# EAGLE design BB_DIO_Cape (EAGLE 6.5.0)

## Sheet 1 of 2
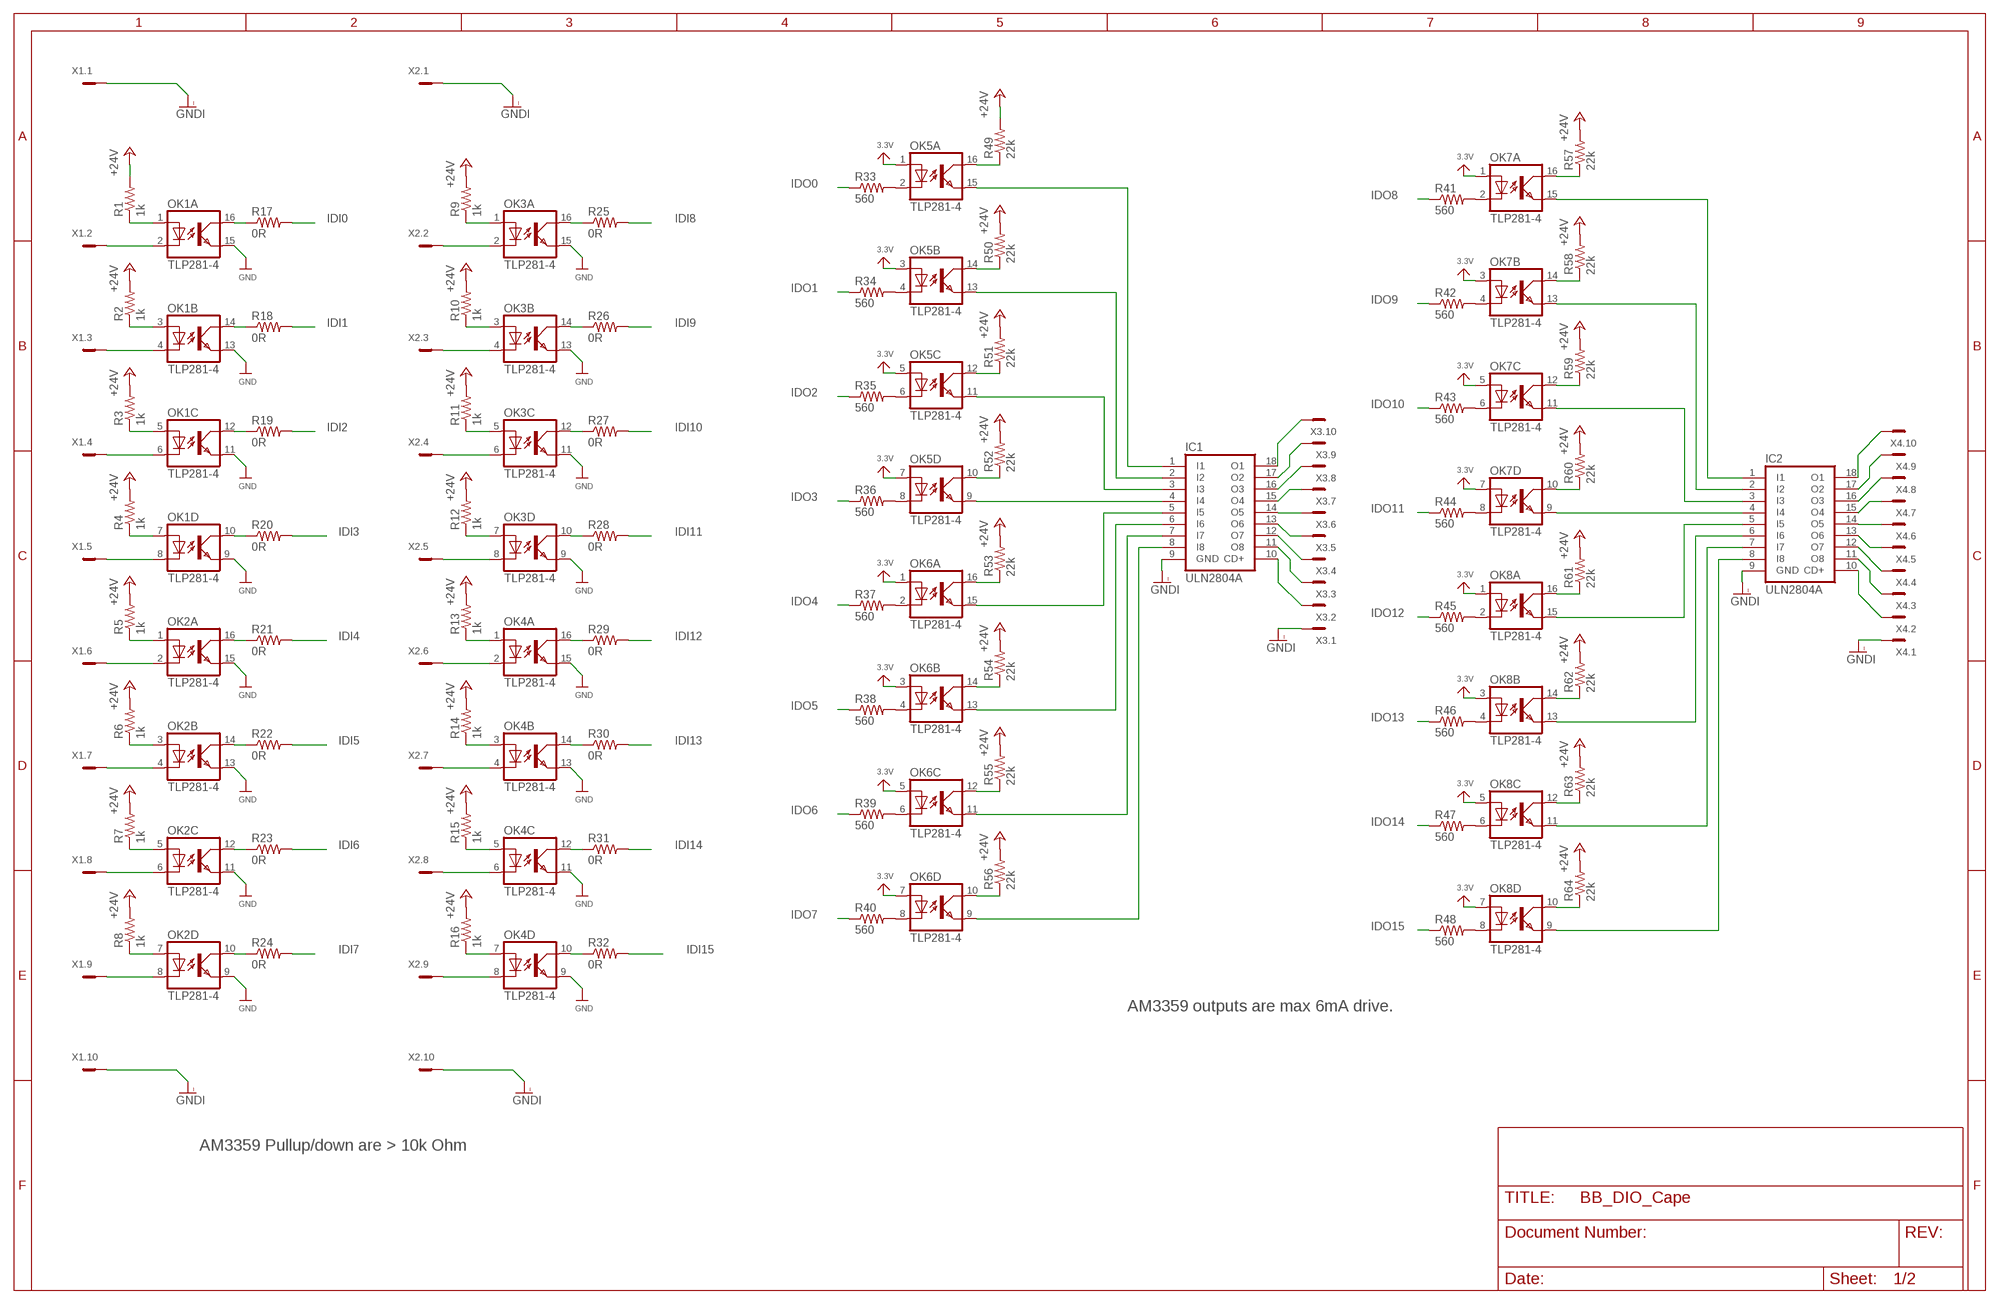
[diagram p0: schematic, sheet 1]

### Parts
IC1  ULN2804A  ULN2803ASOIC18  [SO18W]
IC2  ULN2804A  ULN2803ASOIC18  [SO18W]
OK1  TLP281-4  TLP283-4  [MINI-FLAT-16]
OK2  TLP281-4  TLP283-4  [MINI-FLAT-16]
OK3  TLP281-4  TLP283-4  [MINI-FLAT-16]
OK4  TLP281-4  TLP283-4  [MINI-FLAT-16]
OK5  TLP281-4  TLP283-4  [MINI-FLAT-16]
OK6  TLP281-4  TLP283-4  [MINI-FLAT-16]
OK7  TLP281-4  TLP283-4  [MINI-FLAT-16]
OK8  TLP281-4  TLP283-4  [MINI-FLAT-16]
R1  1k  R-US_R0603  [R0603]
R2  1k  R-US_R0603  [R0603]
R3  1k  R-US_R0603  [R0603]
R4  1k  R-US_R0603  [R0603]
R5  1k  R-US_R0603  [R0603]
R6  1k  R-US_R0603  [R0603]
R7  1k  R-US_R0603  [R0603]
R8  1k  R-US_R0603  [R0603]
R9  1k  R-US_R0603  [R0603]
R10  1k  R-US_R0603  [R0603]
R11  1k  R-US_R0603  [R0603]
R12  1k  R-US_R0603  [R0603]
R13  1k  R-US_R0603  [R0603]
R14  1k  R-US_R0603  [R0603]
R15  1k  R-US_R0603  [R0603]
R16  1k  R-US_R0603  [R0603]
R17  0R  R-US_R0603  [R0603]
R18  0R  R-US_R0603  [R0603]
R19  0R  R-US_R0603  [R0603]
R20  0R  R-US_R0603  [R0603]
R21  0R  R-US_R0603  [R0603]
R22  0R  R-US_R0603  [R0603]
R23  0R  R-US_R0603  [R0603]
R24  0R  R-US_R0603  [R0603]
R25  0R  R-US_R0603  [R0603]
R26  0R  R-US_R0603  [R0603]
R27  0R  R-US_R0603  [R0603]
R28  0R  R-US_R0603  [R0603]
R29  0R  R-US_R0603  [R0603]
R30  0R  R-US_R0603  [R0603]
R31  0R  R-US_R0603  [R0603]
R32  0R  R-US_R0603  [R0603]
R33  560  R-US_R0603  [R0603]
R34  560  R-US_R0603  [R0603]
R35  560  R-US_R0603  [R0603]
R36  560  R-US_R0603  [R0603]
R37  560  R-US_R0603  [R0603]
R38  560  R-US_R0603  [R0603]
R39  560  R-US_R0603  [R0603]
R40  560  R-US_R0603  [R0603]
R41  560  R-US_R0603  [R0603]
R42  560  R-US_R0603  [R0603]
R43  560  R-US_R0603  [R0603]
R44  560  R-US_R0603  [R0603]
R45  560  R-US_R0603  [R0603]
R46  560  R-US_R0603  [R0603]
R47  560  R-US_R0603  [R0603]
R48  560  R-US_R0603  [R0603]
R49  22k  R-US_R0603  [R0603]
R50  22k  R-US_R0603  [R0603]
R51  22k  R-US_R0603  [R0603]
R52  22k  R-US_R0603  [R0603]
R53  22k  R-US_R0603  [R0603]
R54  22k  R-US_R0603  [R0603]
R55  22k  R-US_R0603  [R0603]
R56  22k  R-US_R0603  [R0603]
R57  22k  R-US_R0603  [R0603]
R58  22k  R-US_R0603  [R0603]
R59  22k  R-US_R0603  [R0603]
R60  22k  R-US_R0603  [R0603]
R61  22k  R-US_R0603  [R0603]
R62  22k  R-US_R0603  [R0603]
R63  22k  R-US_R0603  [R0603]
R64  22k  R-US_R0603  [R0603]
X1  MC10  [MC10]
X2  MC10  [MC10]
X3  MC10  [MC10]
X4  MC10  [MC10]

### Nets
3.3V [power]: OK5.1(A:A) OK5.3(B:A) OK5.5(C:A) OK5.7(D:A) OK6.1(A:A) OK6.3(B:A) OK6.5(C:A) OK6.7(D:A) OK7.1(A:A) OK7.3(B:A) OK7.5(C:A) OK7.7(D:A) OK8.1(A:A) OK8.3(B:A) OK8.5(C:A) OK8.7(D:A) ; also sheet 2
+24V [power]: R1.2 R2.2 R3.2 R4.2 R5.2 R6.2 R7.2 R8.2 R9.2 R10.2 R11.2 R12.2 R13.2 R14.2 R15.2 R16.2 R49.2 R50.2 R51.2 R52.2 R53.2 R54.2 R55.2 R56.2 R57.2 R58.2 R59.2 R60.2 R61.2 R62.2 R63.2 R64.2 ; also sheet 2
GND [power]: OK1.9(D:EMIT) OK1.11(C:EMIT) OK1.13(B:EMIT) OK1.15(A:EMIT) OK2.9(D:EMIT) OK2.11(C:EMIT) OK2.13(B:EMIT) OK2.15(A:EMIT) OK3.9(D:EMIT) OK3.11(C:EMIT) OK3.13(B:EMIT) OK3.15(A:EMIT) OK4.9(D:EMIT) OK4.11(C:EMIT) OK4.13(B:EMIT) OK4.15(A:EMIT) ; also sheet 2
GNDI [power]: IC1.9(GND) IC2.9(GND) X1.1 X1.10 X2.1 X2.10 X3.1 X4.1 ; also sheet 2
IDI0: R17.2 ; also sheet 2
IDI1: R18.2 ; also sheet 2
IDI2: R19.2 ; also sheet 2
IDI3: R20.2 ; also sheet 2
IDI4: R21.2 ; also sheet 2
IDI5: R22.2 ; also sheet 2
IDI6: R23.2 ; also sheet 2
IDI7: R24.2 ; also sheet 2
IDI8: R25.2 ; also sheet 2
IDI9: R26.2 ; also sheet 2
IDI10: R27.2 ; also sheet 2
IDI11: R28.2 ; also sheet 2
IDI12: R29.2 ; also sheet 2
IDI13: R30.2 ; also sheet 2
IDI14: R31.2 ; also sheet 2
IDI15: R32.2
IDO0: R33.1 ; also sheet 2
IDO1: R34.1 ; also sheet 2
IDO2: R35.1 ; also sheet 2
IDO3: R36.1 ; also sheet 2
IDO4: R37.1 ; also sheet 2
IDO5: R38.1 ; also sheet 2
IDO6: R39.1 ; also sheet 2
IDO7: R40.1 ; also sheet 2
IDO8: R41.1 ; also sheet 2
IDO9: R42.1 ; also sheet 2
IDO10: R43.1 ; also sheet 2
IDO11: R44.1 ; also sheet 2
IDO12: R45.1 ; also sheet 2
IDO13: R46.1 ; also sheet 2
IDO14: R47.1 ; also sheet 2
IDO15: R48.1 ; also sheet 2
N$1: OK4.8(D:C) X2.9
N$2: OK4.7(D:A) R16.1
N$3: OK4.5(C:A) R15.1
N$4: OK4.6(C:C) X2.8
N$5: OK4.4(B:C) X2.7
N$6: OK4.3(B:A) R14.1
N$7: OK4.2(A:C) X2.6
N$8: OK4.1(A:A) R13.1
N$9: OK3.8(D:C) X2.5
N$10: OK3.7(D:A) R12.1
N$11: OK3.6(C:C) X2.4
N$12: OK3.5(C:A) R11.1
N$13: OK3.4(B:C) X2.3
N$14: OK3.3(B:A) R10.1
N$15: OK4.10(D:COL) R32.1
N$16: OK4.12(C:COL) R31.1
N$17: OK4.14(B:COL) R30.1
N$18: OK4.16(A:COL) R29.1
N$19: OK3.10(D:COL) R28.1
N$20: OK3.12(C:COL) R27.1
N$21: OK3.14(B:COL) R26.1
N$22: OK2.10(D:COL) R24.1
N$23: OK2.12(C:COL) R23.1
N$24: OK2.14(B:COL) R22.1
N$25: OK2.16(A:COL) R21.1
N$26: OK1.10(D:COL) R20.1
N$27: OK1.12(C:COL) R19.1
N$28: OK1.14(B:COL) R18.1
N$29: OK1.4(B:C) X1.3
N$30: OK1.3(B:A) R2.1
N$31: OK1.5(C:A) R3.1
N$32: OK1.6(C:C) X1.4
N$33: OK1.7(D:A) R4.1
N$34: OK1.8(D:C) X1.5
N$35: OK2.2(A:C) X1.6
N$36: OK2.1(A:A) R5.1
N$37: OK2.3(B:A) R6.1
N$38: OK2.4(B:C) X1.7
N$39: OK2.5(C:A) R7.1
N$40: OK2.6(C:C) X1.8
N$41: OK2.7(D:A) R8.1
N$42: OK2.8(D:C) X1.9
N$43: OK1.2(A:C) X1.2
N$44: OK1.1(A:A) R1.1
N$45: OK1.16(A:COL) R17.1
N$46: OK3.2(A:C) X2.2
N$47: OK3.1(A:A) R9.1
N$48: OK3.16(A:COL) R25.1
N$49: OK5.2(A:C) R33.2
N$50: OK5.4(B:C) R34.2
N$51: OK5.6(C:C) R35.2
N$52: OK5.8(D:C) R36.2
N$53: OK6.2(A:C) R37.2
N$54: OK6.4(B:C) R38.2
N$55: OK6.6(C:C) R39.2
N$56: OK6.8(D:C) R40.2
N$57: OK7.2(A:C) R41.2
N$58: OK7.4(B:C) R42.2
N$59: OK7.6(C:C) R43.2
N$60: OK7.8(D:C) R44.2
N$61: OK8.2(A:C) R45.2
N$62: OK8.4(B:C) R46.2
N$63: OK8.6(C:C) R47.2
N$64: OK8.8(D:C) R48.2
N$65: OK5.16(A:COL) R49.1
N$66: OK5.14(B:COL) R50.1
N$67: OK5.12(C:COL) R51.1
N$68: OK5.10(D:COL) R52.1
N$69: OK6.16(A:COL) R53.1
N$70: OK6.14(B:COL) R54.1
N$71: OK6.12(C:COL) R55.1
N$72: OK6.10(D:COL) R56.1
N$73: IC1.8(I8) OK6.9(D:EMIT)
N$74: IC1.7(I7) OK6.11(C:EMIT)
N$75: IC1.6(I6) OK6.13(B:EMIT)
N$76: IC1.5(I5) OK6.15(A:EMIT)
N$77: IC1.4(I4) OK5.9(D:EMIT)
N$78: IC1.3(I3) OK5.11(C:EMIT)
N$79: IC1.2(I2) OK5.13(B:EMIT)
N$80: IC1.1(I1) OK5.15(A:EMIT)
N$81: OK8.14(B:COL) R62.1
N$82: OK8.12(C:COL) R63.1
N$83: OK8.10(D:COL) R64.1
N$84: IC2.8(I8) OK8.9(D:EMIT)
N$85: IC2.7(I7) OK8.11(C:EMIT)
N$86: IC2.6(I6) OK8.13(B:EMIT)
N$87: IC2.5(I5) OK8.15(A:EMIT)
N$88: OK8.16(A:COL) R61.1
N$89: OK7.10(D:COL) R60.1
N$90: OK7.12(C:COL) R59.1
N$91: IC2.4(I4) OK7.9(D:EMIT)
N$92: IC2.3(I3) OK7.11(C:EMIT)
N$93: IC2.2(I2) OK7.13(B:EMIT)
N$94: OK7.14(B:COL) R58.1
N$95: OK7.16(A:COL) R57.1
N$96: IC2.1(I1) OK7.15(A:EMIT)
N$97: IC2.18(O1) X4.10
N$98: IC2.10(CD+) X4.2
N$99: IC2.11(O8) X4.3
N$100: IC2.17(O2) X4.9
N$101: IC2.12(O7) X4.4
N$102: IC2.13(O6) X4.5
N$103: IC2.14(O5) X4.6
N$104: IC2.15(O4) X4.7
N$105: IC2.16(O3) X4.8
N$106: IC1.14(O5) X3.6
N$107: IC1.13(O6) X3.5
N$108: IC1.12(O7) X3.4
N$109: IC1.15(O4) X3.7
N$110: IC1.16(O3) X3.8
N$111: IC1.17(O2) X3.9
N$112: IC1.11(O8) X3.3
N$113: IC1.10(CD+) X3.2
N$114: IC1.18(O1) X3.10

### Notes on the sheet
- AM3359 outputs are max 6mA drive.
- AM3359 Pullup/down are > 10k Ohm

## Sheet 2 of 2
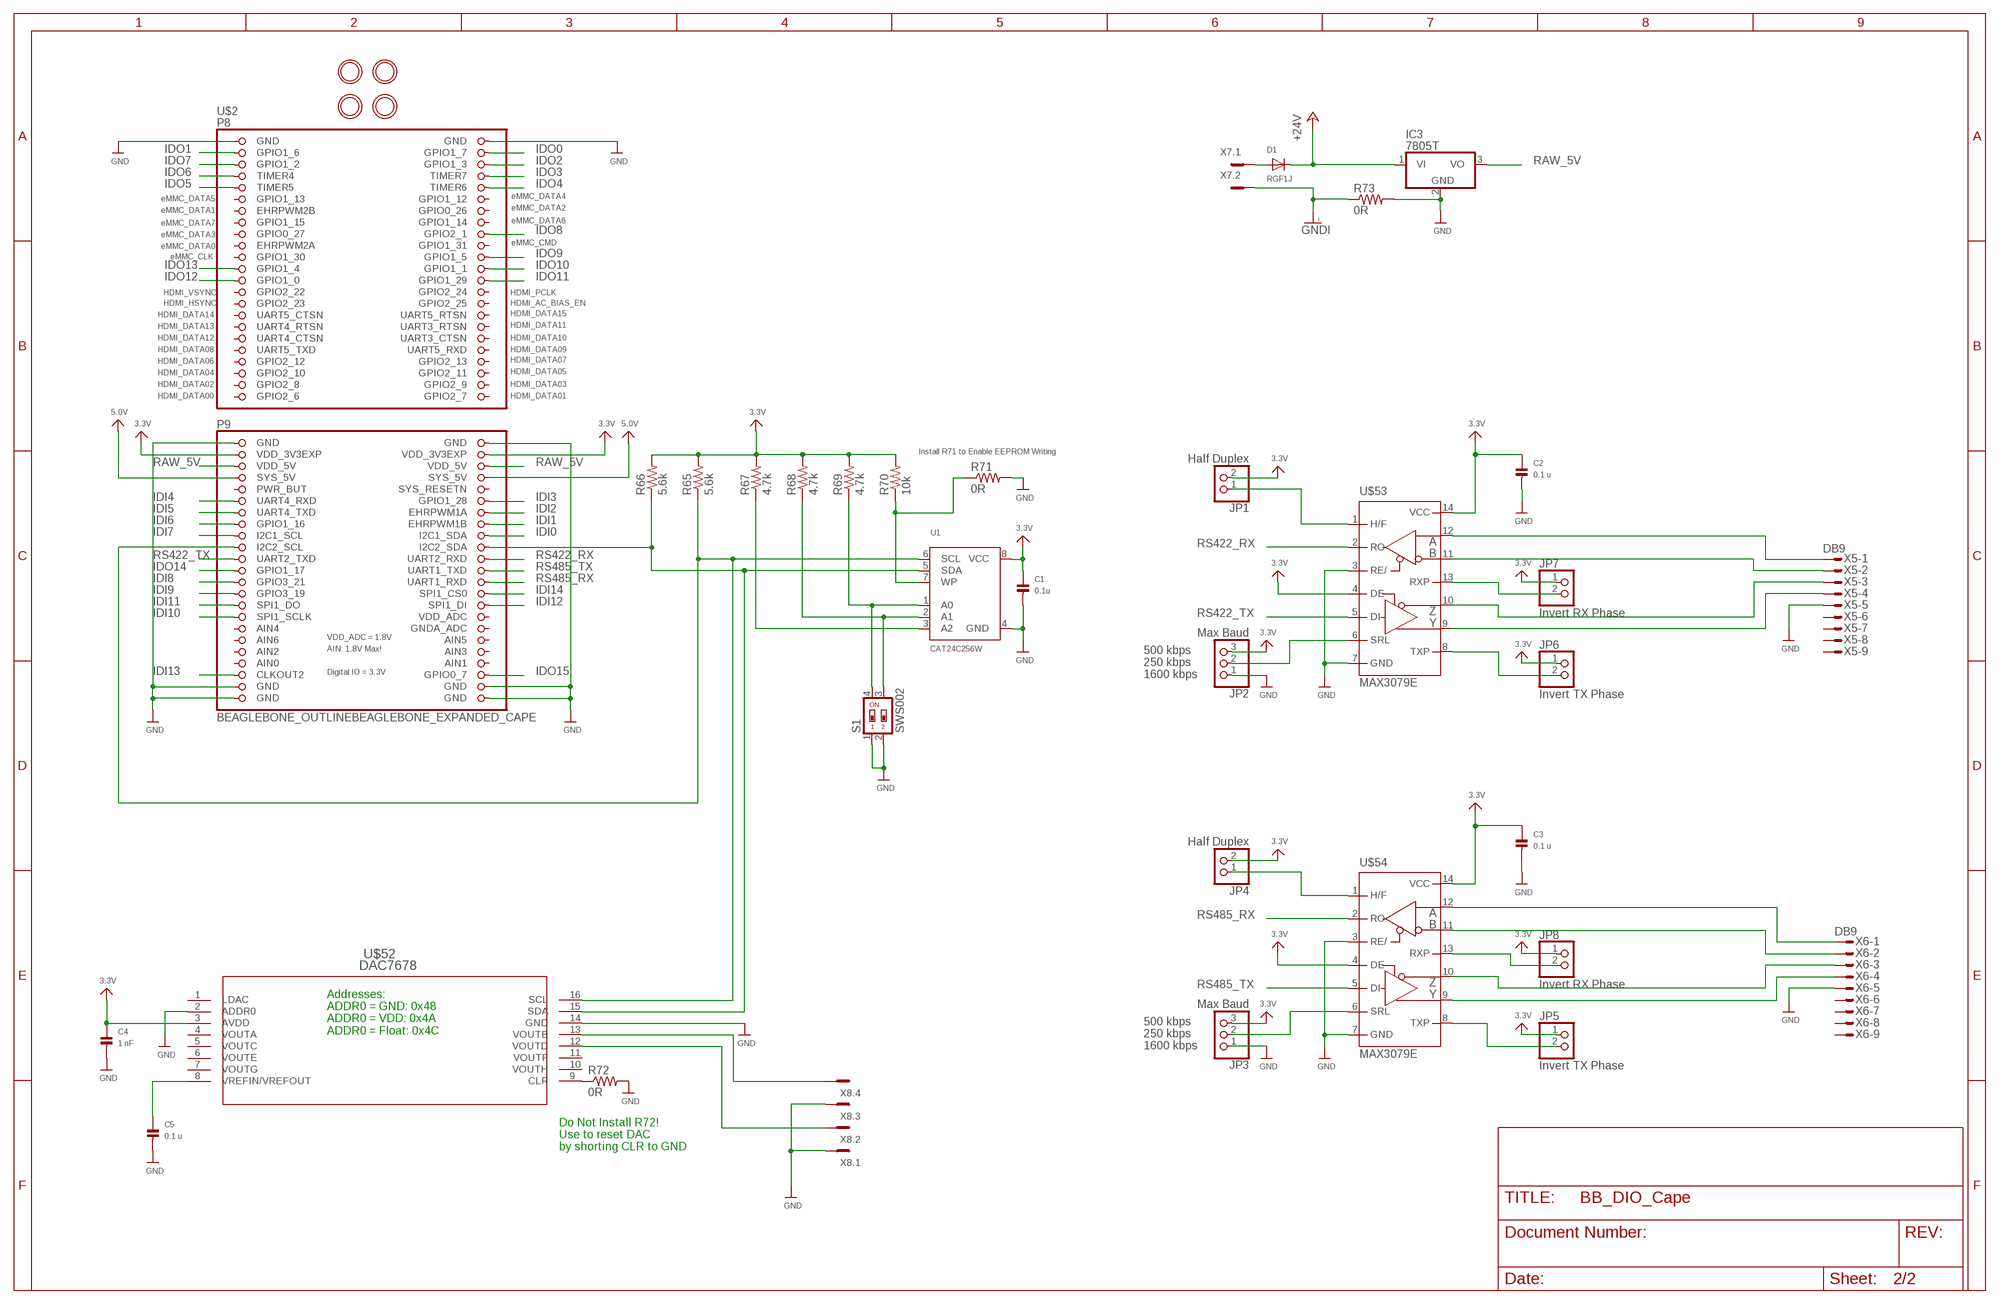
[diagram p1: schematic, sheet 2]

### Parts
C1  0.1u  CAP_CERAMIC_0603  [_0603]
C2  0.1 u  CAP_CERAMIC0603  [0603]
C3  0.1 u  CAP_CERAMIC0603  [0603]
C4  1 nF  CAP_CERAMIC0603  [0603]
C5  0.1 u  CAP_CERAMIC0603  [0603]
D1  RGF1J  DIODESMA  [SMADIODE]
IC3  7805T  [TO220H]
JP1  Half Duplex  HEADER-1X2ROUND  [1X02_ROUND]
JP2  Max Baud  HEADER-1X3ROUND  [1X03_ROUND]
JP3  Max Baud  HEADER-1X3ROUND  [1X03_ROUND]
JP4  Half Duplex  HEADER-1X2ROUND  [1X02_ROUND]
JP5  Invert TX Phase  HEADER-1X2ROUND  [1X02_ROUND]
JP6  Invert TX Phase  HEADER-1X2ROUND  [1X02_ROUND]
JP7  Invert RX Phase  HEADER-1X2ROUND  [1X02_ROUND]
JP8  Invert RX Phase  HEADER-1X2ROUND  [1X02_ROUND]
R65  5.6k  R-US_R0603  [R0603]
R66  5.6k  R-US_R0603  [R0603]
R67  4.7k  R-US_R0603  [R0603]
R68  4.7k  R-US_R0603  [R0603]
R69  4.7k  R-US_R0603  [R0603]
R70  10k  R-US_R0603  [R0603]
R71  0R  R-US_R0603  [R0603]
R72  0R  R-US_R0603  [R0603]
R73  0R  R-US_M1206  [M1206]
S1  SWS002  [SMS-002]
U1  CAT24C256W  EEPROM_I2C_SOIC8_GENERIC  [SOIC8_150MIL]
U$2  BEAGLEBONE_OUTLINEBEAGLEBONE_EXPANDED_CAPE  [BEAGLEBONE_SHIELD]
U$22  MOUNTINGHOLE3.0THIN  [MOUNTINGHOLE_3.0_PLATEDTHIN]
U$23  MOUNTINGHOLE3.0THIN  [MOUNTINGHOLE_3.0_PLATEDTHIN]
U$52  DAC7678  [PW16]
U$53  MAX3079E  [SO14]
U$54  MAX3079E  [SO14]
U$71  MOUNTINGHOLE3.0THIN  [MOUNTINGHOLE_3.0_PLATEDTHIN]
U$72  MOUNTINGHOLE3.0THIN  [MOUNTINGHOLE_3.0_PLATEDTHIN]
X5  DB9  M09-182S  [182-009-MALE]
X6  DB9  M09-182S  [182-009-MALE]
X7  MC2  [MC2]
X8  MC4  [MC4]

### Nets
3.3V [power]: C1.1 C2.1 C3.1 C4.1 JP1.2 JP2.3 JP3.3 JP4.2 JP5.1 JP6.1 JP7.1 JP8.1 R65.2 R66.2 R67.2 R68.2 R69.2 R70.2 U1.8(VCC) U$2.49(VDD_3V3EXP) U$2.50(VDD_3V3EXP) U$52.3(AVDD) U$53.4(DE) U$53.14(VCC) U$54.4(DE) U$54.14(VCC) ; also sheet 1
5.0V: U$2.53(SYS_5V) U$2.54(SYS_5V)
+24V [power]: D1.C IC3.1(VI) ; also sheet 1
GND [power]: C1.2 C2.2 C3.2 C4.2 C5.2 IC3.2(GND) JP2.1 JP3.1 R71.2 R72.2 R73.2 S1.1 S1.2 U1.4(GND) U$2.1(GND) U$2.2(GND) U$2.47(GND) U$2.48(GND) U$2.89(GND) U$2.90(GND) U$2.91(GND) U$2.92(GND) U$52.2(ADDR0) U$52.14(GND) U$53.3(RE/) U$53.7(GND) U$54.3(RE/) U$54.7(GND) X5.5 X6.5 X8.1 X8.3 ; also sheet 1
GNDI [power]: R73.1 X7.2 ; also sheet 1
IDI0: U$2.64(I2C1_SDA) ; also sheet 1
IDI1: U$2.62(EHRPWM1B) ; also sheet 1
IDI2: U$2.60(EHRPWM1A) ; also sheet 1
IDI3: U$2.58(GPIO1_28) ; also sheet 1
IDI4: U$2.57(UART4_RXD) ; also sheet 1
IDI5: U$2.59(UART4_TXD) ; also sheet 1
IDI6: U$2.61(GPIO1_16) ; also sheet 1
IDI7: U$2.63(I2C1_SCL) ; also sheet 1
IDI8: U$2.71(GPIO3_21) ; also sheet 1
IDI9: U$2.73(GPIO3_19) ; also sheet 1
IDI10: U$2.77(SPI1_SCLK) ; also sheet 1
IDI11: U$2.75(SPI1_DO) ; also sheet 1
IDI12: U$2.76(SPI1_DI) ; also sheet 1
IDI13: U$2.87(CLKOUT2) ; also sheet 1
IDI14: U$2.74(SPI1_CS0) ; also sheet 1
IDO0: U$2.4(GPIO1_7) ; also sheet 1
IDO1: U$2.3(GPIO1_6) ; also sheet 1
IDO2: U$2.6(GPIO1_3) ; also sheet 1
IDO3: U$2.8(TIMER7) ; also sheet 1
IDO4: U$2.10(TIMER6) ; also sheet 1
IDO5: U$2.9(TIMER5) ; also sheet 1
IDO6: U$2.7(TIMER4) ; also sheet 1
IDO7: U$2.5(GPIO1_2) ; also sheet 1
IDO8: U$2.18(GPIO2_1) ; also sheet 1
IDO9: U$2.22(GPIO1_5) ; also sheet 1
IDO10: U$2.24(GPIO1_1) ; also sheet 1
IDO11: U$2.26(GPIO1_29) ; also sheet 1
IDO12: U$2.25(GPIO1_0) ; also sheet 1
IDO13: U$2.23(GPIO1_4) ; also sheet 1
IDO14: U$2.69(GPIO1_17) ; also sheet 1
IDO15: U$2.88(GPIO0_7) ; also sheet 1
N$115: D1.A X7.1
N$116: C5.1 U$52.8(VREFIN/VREFOUT)
N$117: R72.1 U$52.9(CLR)
N$118: JP3.2 U$54.6(SRL)
N$119: R69.1 S1.4 U1.1(A0)
N$120: R70.1 R71.1 U1.7(WP)
N$121: JP2.2 U$53.6(SRL)
N$122: JP7.2 U$53.13(RXP)
N$123: JP6.2 U$53.8(TXP)
N$124: JP5.2 U$54.8(TXP)
N$125: JP4.1 U$54.1(H/F)
N$126: JP1.1 U$53.1(H/F)
N$127: JP8.2 U$54.13(RXP)
N$128: U$52.13(VOUTB) X8.4
N$129: U$52.12(VOUTD) X8.2
N$130: U$54.9(Y) X6.4
N$131: U$53.10(Z) X5.3
N$132: U$53.9(Y) X5.4
N$133: U$53.12(A) X5.1
N$134: U$53.11(B) X5.2
N$135: U$54.11(B) X6.2
N$136: U$54.12(A) X6.1
N$137: U$54.10(Z) X6.3
N$139: R68.1 S1.3 U1.2(A1)
N$140: R67.1 U1.3(A2)
RAW_5V: IC3.3(VO) U$2.51(VDD_5V) U$2.52(VDD_5V)
RS422_RX: U$2.68(UART2_RXD) U$53.2(RO)
RS422_TX: U$2.67(UART2_TXD) U$53.5(DI)
RS485_RX: U$2.72(UART1_RXD) U$54.2(RO)
RS485_TX: U$2.70(UART1_TXD) U$54.5(DI)
SCL: R65.1 U1.6(SCL) U$2.65(I2C2_SCL) U$52.16(SCL)
SDA: R66.1 U1.5(SDA) U$2.66(I2C2_SDA) U$52.15(SDA)
Unconnected: U$2.11(GPIO1_13) U$2.12(GPIO1_12) U$2.13(EHRPWM2B) U$2.14(GPIO0_26) U$2.15(GPIO1_15) U$2.16(GPIO1_14) U$2.17(GPIO0_27) U$2.19(EHRPWM2A) U$2.20(GPIO1_31) U$2.21(GPIO1_30) U$2.27(GPIO2_22) U$2.28(GPIO2_24) U$2.29(GPIO2_23) U$2.30(GPIO2_25) U$2.31(UART5_CTSN) U$2.32(UART5_RTSN) U$2.33(UART4_RTSN) U$2.34(UART3_RTSN) U$2.35(UART4_CTSN) U$2.36(UART3_CTSN) U$2.37(UART5_TXD) U$2.38(UART5_RXD) U$2.39(GPIO2_12) U$2.40(GPIO2_13) U$2.41(GPIO2_10) U$2.42(GPIO2_11) U$2.43(GPIO2_8) U$2.44(GPIO2_9) U$2.45(GPIO2_6) U$2.46(GPIO2_7) U$2.55(PWR_BUT) U$2.56(SYS_RESETN) U$2.79(AIN4) U$2.81(AIN6) U$2.82(AIN5) U$2.83(AIN2) U$2.84(AIN3) U$2.85(AIN0) U$2.86(AIN1) U$52.1(LDAC) U$52.4(VOUTA) U$52.5(VOUTC) U$52.6(VOUTE) U$52.7(VOUTG) U$52.10(VOUTH) U$52.11(VOUTF) X5.6 X5.7 X5.8 X5.9 X6.6 X6.7 X6.8 X6.9

### Notes on the sheet
- eMMC_DATA5 | eMMC_DATA4
- eMMC_DATA2
- eMMC_DATA1
- eMMC_DATA7 | eMMC_DATA6
- eMMC_DATA3
- eMMC_CMD
- eMMC_DATA0
- eMMC_CLK
- HDMI_VSYNC | HDMI_PCLK
- HDMI_HSYNC | HDMI_AC_BIAS_EN
- HDMI_DATA14 | HDMI_DATA15
- HDMI_DATA13 | HDMI_DATA11
- HDMI_DATA12 | HDMI_DATA10
- HDMI_DATA08 | HDMI_DATA09
- HDMI_DATA06 | HDMI_DATA07
- HDMI_DATA04 | HDMI_DATA05
- HDMI_DATA02 | HDMI_DATA03
- HDMI_DATA00 | HDMI_DATA01
- Install R71 to Enable EEPROM Writing
- 500 kbps
  250 kbps
  1600 kbps
- Addresses: 
  ADDR0 = GND: 0x48
  ADDR0 = VDD: 0x4A
  ADDR0 = Float: 0x4C
- 500 kbps
  250 kbps
  1600 kbps
- Do Not Install R72!
  Use to reset DAC
  by shorting CLR to GND

## Power pins joined to a net without a drawn wire
GNDA_ADC: U$2.80(GNDA_ADC)
VDD_ADC: U$2.78(VDD_ADC)

## Library data of the parts
C1-C5 = microbuilder:CAP_CERAMIC: Ceramic Capacitors 0402 - 0402 Surface Mount Capacitors 16pF 50V 5% [Digikey: 445-4899-2-ND] 18pF 50V 5% [Digikey: 490-1281-2-ND] 22pF 50V 5% [Digikey: 490-1283-2-ND] 68pF 50V 5% [Digikey: 490-1289-2-ND] 0.1uF 10V 10% [Digikey: 490-1318-2-ND] 1.0uF 6.3V 10% [Digikey: 490-1320-2-ND] 0603 - 0603 Surface Mount Capacitors 16 pF 50V 5% [Digikey: 445-5051-2-ND] 22 pF 50V [Digikey: PCC220ACVTR-ND] 33 pF 50V 5% [Digikey: 490-1415-1-ND] 56pF 50V 5% [Digikey: 490-1421-1-ND] 220pF 50V 5% [Digikey: 445-1285-1-ND] 680 pF 50V 2200 pF 50V 5% C0G [Digikey: 445-1297-1-ND] 5600 pF 100V 5% X7R [Digikey: 478-3711-1-ND] 0.1 µF 25V 10% [Digikey: PCC2277TR-ND] 0.22 µF 16V 10% X7R [Digikey: 445-1318-1-ND] 1.0 µF 25V 10% [Digikey: 445-5146-2-ND] 0603 - RF Specific 3pF 250V +/-0.1pF RF [Digikey: 712-1347-1-ND] 18 pF 250V 5% [Digikey: 478-3505-1-ND or 712-1322-1-ND] 56 pF 250V 5% C0G RF [Digikey: 490-4867-1-ND] 68 pF 250V RF [Digikey: 490-4868-1-ND] 0805 - 0805 Surface Mount Capacitors 220 pF 250V 2% RF Ceramic Capacitor [Digikey: 712-1398-1-ND] 1000 pF 50V 2% NP0 Ceramic Capacitor [Digikey: 478-3760-1-ND] 0.1 µF 25V 10% Ceramic Capacitor [Digikey: PCC1828TR-ND] 1.0 µF 16V 10% Ceramic Capacitor[Digikey: 490-1691-2-ND] 10.0 µF 10V 10% Ceramic Capacitor[Digikey: 709-1228-1-ND] 10.0 uF 16V 10% Ceramic Capacitor [Digikey: 478-5165-2-ND] 47 uF 6.3V 20% Ceramic Capacitor [Digikey: 587-1779-1-ND or 399-5506-1-ND] 1206 - 1206 Surface Mount Capacitors 47uF 10V 20% Ceramic Capacitor [Digikey: 490-5528-1-ND or 399-5508-1-ND or 445-6010-1-ND] 100uF 6.3V -20%, +80% Y5V Ceramic Capacitor (Digikey: 490-4512-1-ND, Mouser: 81-GRM31CF50J107ZE1L)
D1 = microbuilder:DIODE: Diode SMA Model Volts Amps Type Vf Vr Digikey # Notes SSA34-E3 40V 3A Schottky 480mV @ 3A 200uA @ 40V SSA34-E3/61TGITR-ND CDBA120-G 20V 1A Schottky 500mV @ 1A 500uA @ 20V 641-1014-6-ND REEL MBRA210 10V 2A Schottky 350mV @ 2A 700uA @ 10V MBRA210LT3 SOD-123 Model Volts Amps Type Vf Vr Order # Notes BAT54T1G 30V 200mA Schottky 800mV @ 200mA 2uA @ 25V BAT54T1GOSTR-ND B0530W 30V 500mA Schottky 430mV @ 500mA 130uA @ 30V B0530W-FDICT-ND REEL MBR120 1A 20V Schottky 340mV @ 1A MBR120VLSFT1GOSCT-ND SOD-323 Model Volts Amps Type Vf Vr Order # Notes PMEG2005EJ 20V 500mA Schottky 355mV @ 500mA 568-4110-1-ND ZLLS410 10V 570mA Schottky 380mV @ 570mA ZLLS410CT-ND 1N4148WS 75V 150mA Silicon/Simple 1V 1N4148WSFSCT-ND REEL SOD-523 Model Volts Amps Type Vf Vr Order # Notes BAT54XV2 30V 200mA Schottky 0.8V @ 100mA BAT54XV2CT-ND TB751S 30V 30mA Schottky RB751S-40TE61CT-ND SOT23-R/W (R = Solder Paste/Reflow Ovens, W = Hand-Soldering) Model Volts Amps Type Vf Vr Order # Notes BAT54FILM 40V 300mA Schottky 497-7162-1-ND
IC1 IC2 = uln-udn:ULN2803A: DRIVER ARRAY
IC3 = linear:78*: Positive VOLTAGE REGULATOR Source: http://cache.national.com/ds/LM/LM78L05.pdf http://www.fairchildsemi.com/ds/LM/LM7805.pdf
JP1 JP4-JP8 = microbuilder:HEADER-1X2: PIN HEADER
JP2 JP3 = microbuilder:HEADER-1X3: PIN HEADER
OK1-OK8 = optocoupler:TLP283-4: TOSHIBA PHOTOCOUPLER GaAs IRED & PHOTO-TRANSISTOR Source: http://www.semicon.toshiba.co.jp/td/en/Opto/Photocoupler/en_20050928_TLP283_datasheet.pdf; OC_FARNELL: unknown; OC_NEWARK: unknown
R1-R73 = resistor:R-US_: RESISTOR, American symbol
S1 = smd-special:SWS002: SMD Dip Switch 2 pol.
U1 = microbuilder:EEPROM_I2C_SOIC8_GENERIC: Note: The same pinout is used for many I2C EEPROMs in SOIC8(150mil) from a variety of manufacturers and in various sizes. Examples: 16K (2K x 8 Bit) I2C EEPROM 1.7-5.5V, 400KHz, -40°C-85°C Digikey: CAT24C16WI-GT3CT-ND 256K (32K x 8 Bit) I2C EEPROM 1.7-5.5V, 400KHz, -40°C-85°C Digikey: 24AA256-I/SN-ND
U$2 = microbuilder:BEAGLEBONE_OUTLINE
U$22 U$23 U$71 U$72 = microbuilder:MOUNTINGHOLE: Mounting Hole
U$52 = ti-dac:DAC7678
U$53 U$54 = maxim:MAX3079E
X1-X4 = con-phoenix-381_l:MC10: Mini-Combicon 3.81mm horizontal 10-polig (ohne Gegenstecker)
X5 X6 = con-subd:M09?S: SUB-D; OC_FARNELL: unknown; OC_NEWARK: unknown
X7 = con-phoenix-381_l:MC2: Mini-Combicon 3.81mm horizontal 2-polig (ohne Gegenstecker)
X8 = con-phoenix-381_l:MC4: Mini-Combicon 3.81mm horizontal 4-polig (ohne Gegenstecker)

## Net classes
0 default: clearance 0.355 mm
1 power: width 0.813 mm, clearance 0.009 mm

## Board
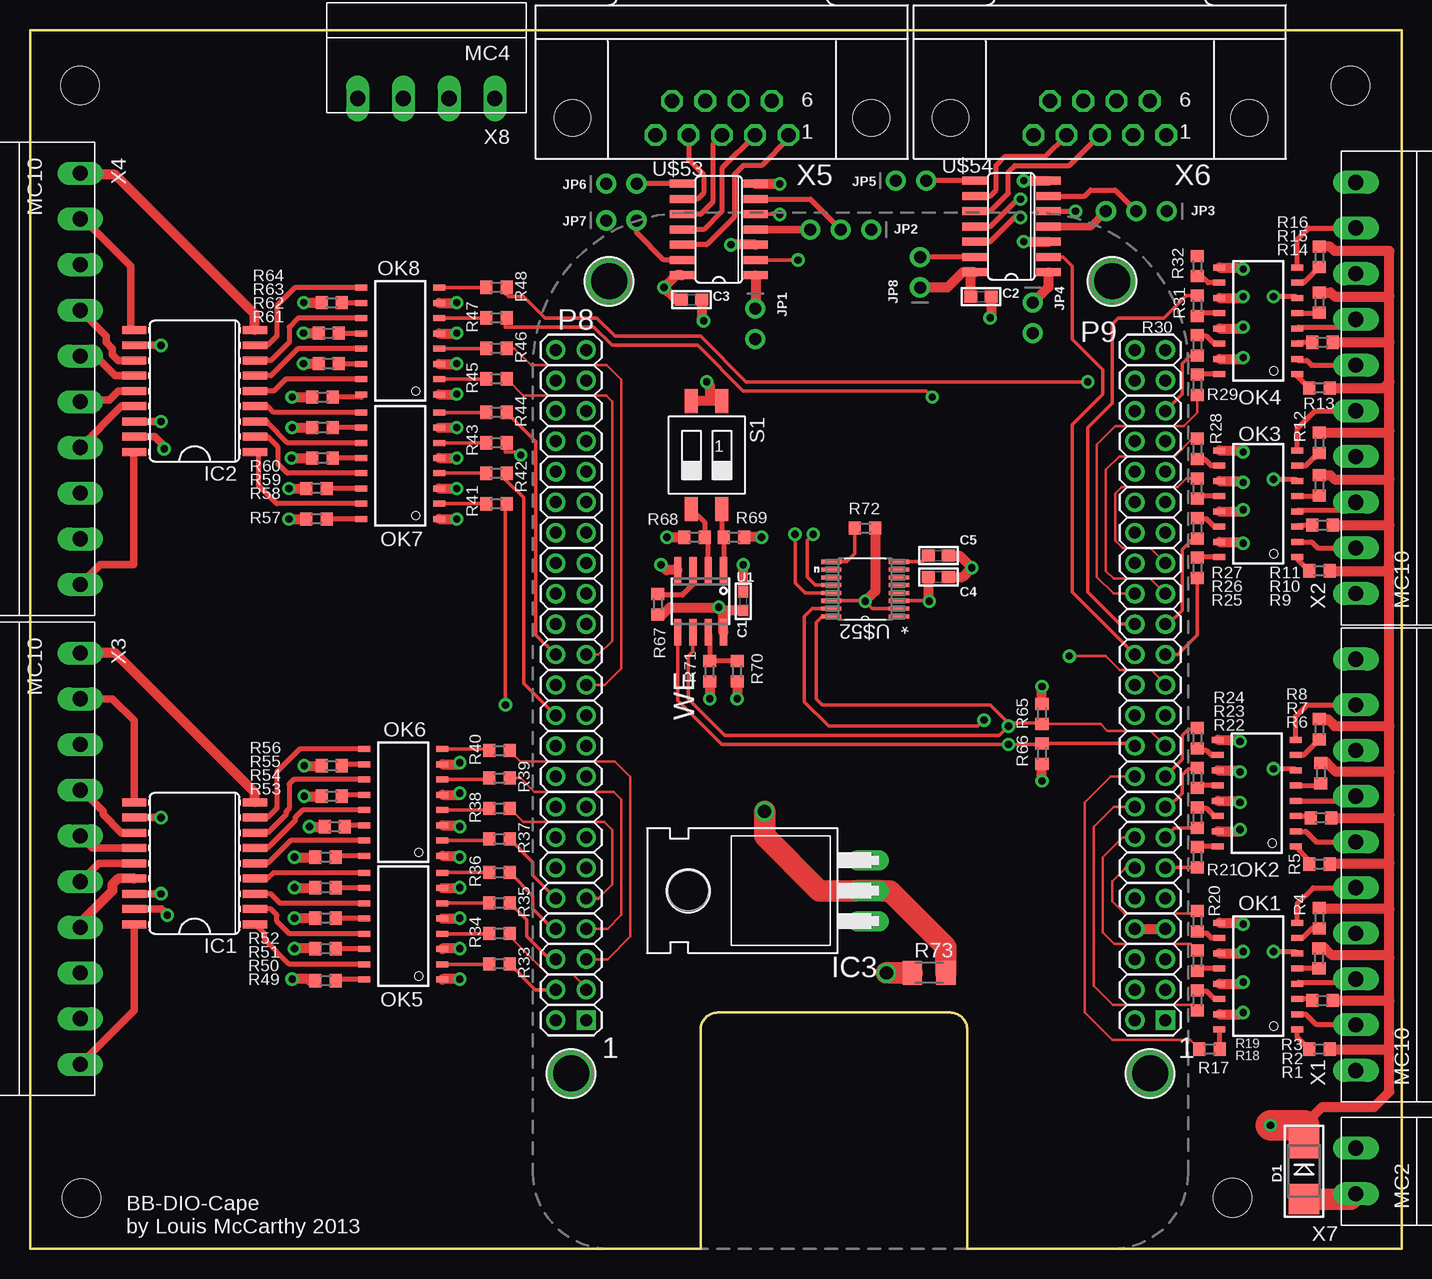
[diagram p2: board, top side]
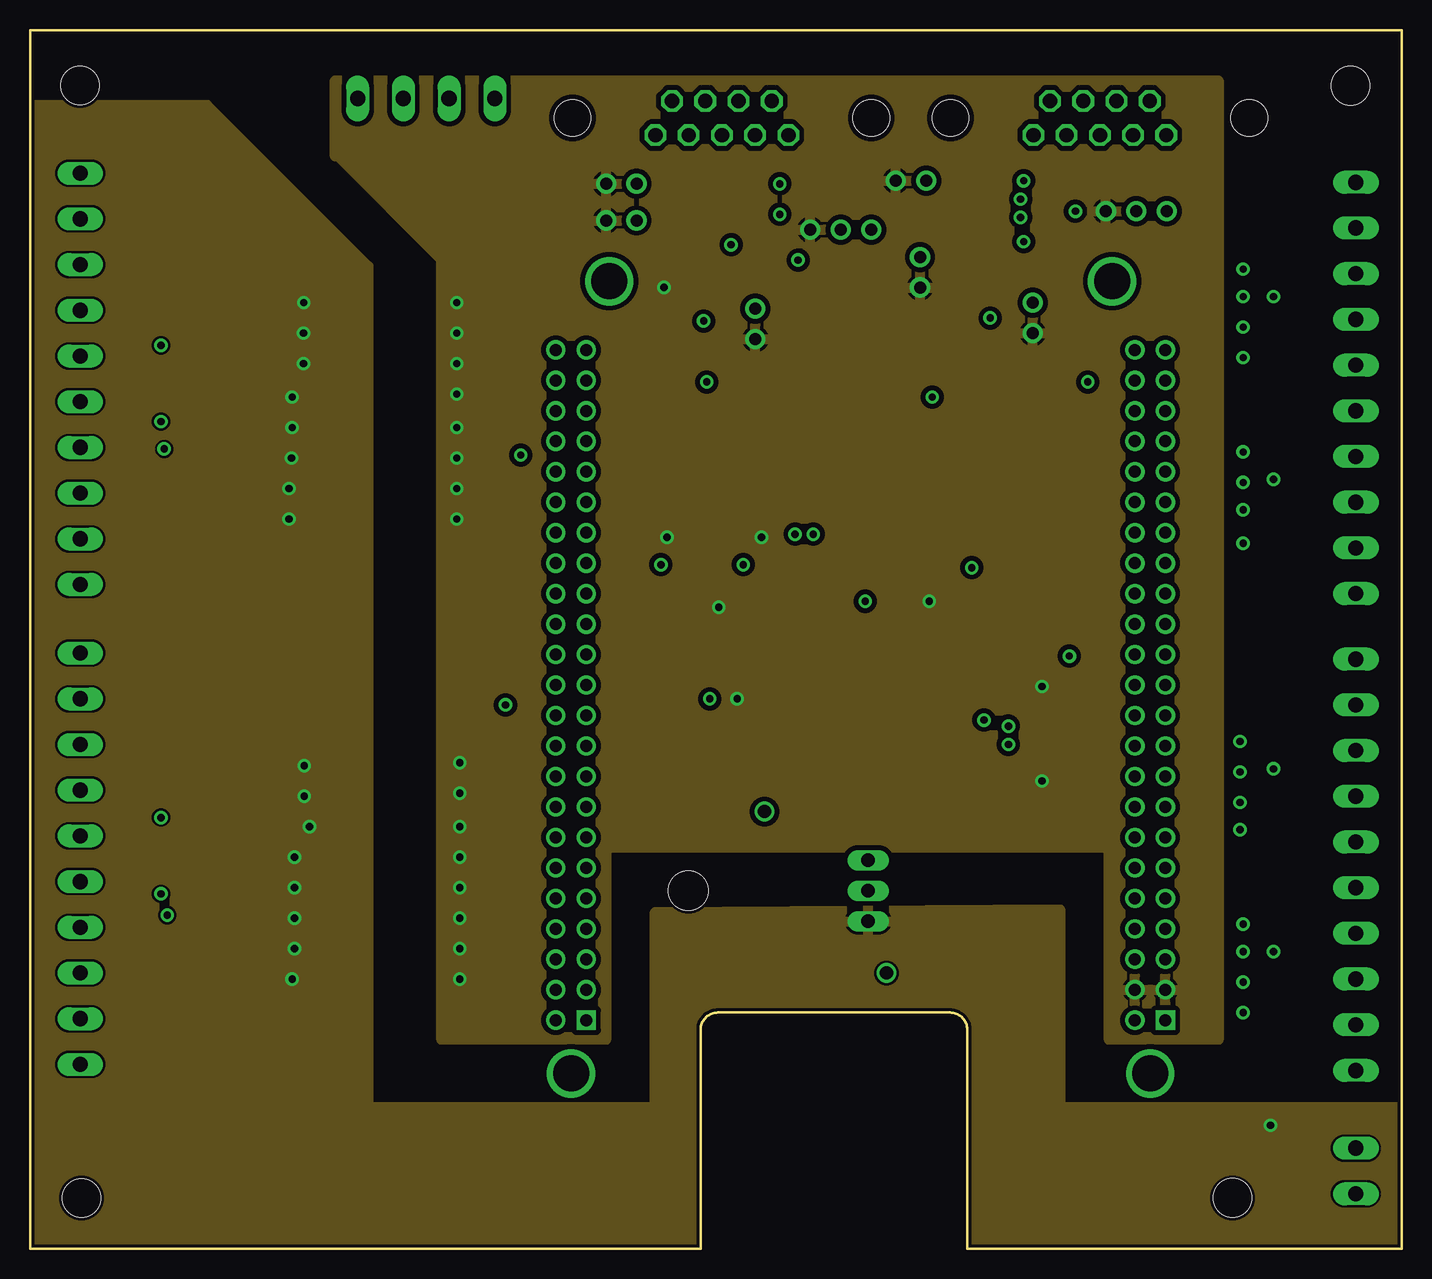
[diagram p3: board, inner layer VCC]
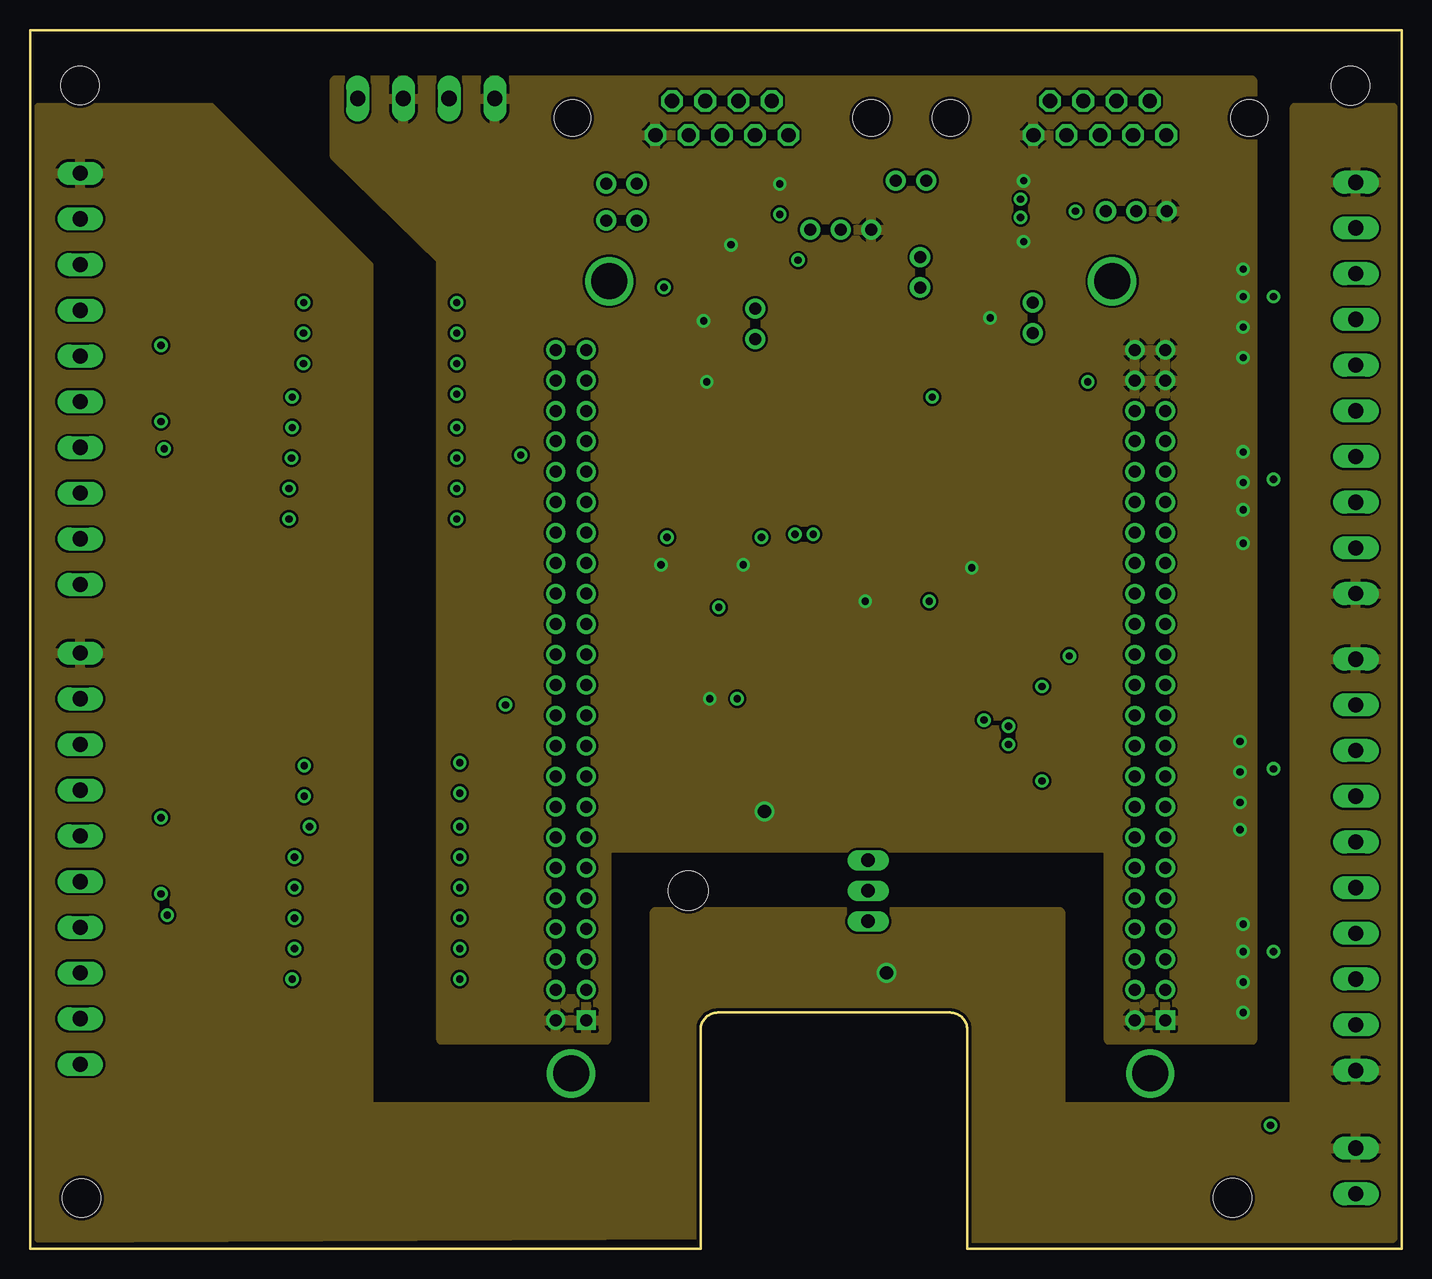
[diagram p4: board, inner layer GND]
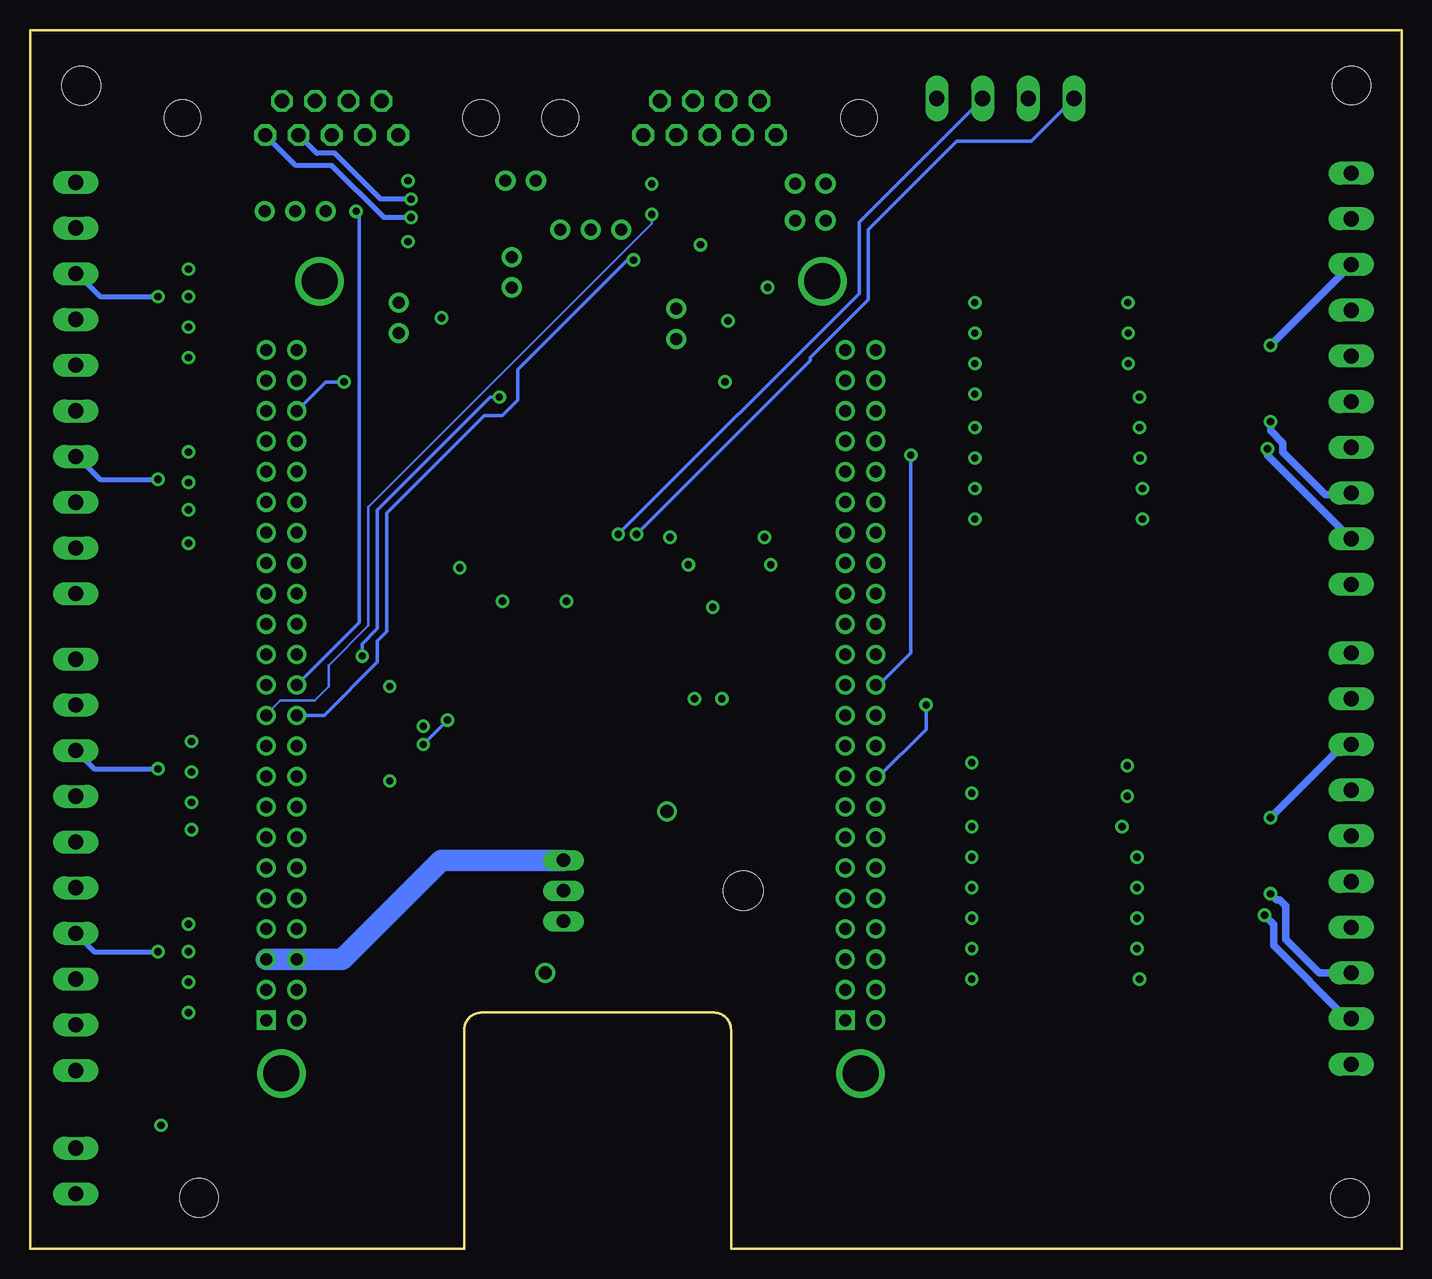
[diagram p5: board, bottom side, seen from below]

Size 114.3 x 101.6 mm. Coordinates in mm from the lower left corner, seen from the top.
Copper layers (1+2*15+16): Top 0.0356mm / dielectric 0.2mm / VCC 0.0356mm / dielectric 0.2mm / GND 0.0356mm / dielectric 0.2mm / Bottom 0.0356mm
Design rules "LaenPCBOrder *": minimum track width 8mil, minimum drill 20mil, track to track 8mil, track to pad 8mil, pad to pad 8mil, via to via 8mil, smd to smd 8mil, copper to edge 10mil, drill to drill 8mil, minimum pad ring 12mil, minimum via ring 10mil, stop-mask expansion 4mil, vias tented up to drill 25mil, thermal gap 10mil
Holes 3.2 mm at 4.17,96.98 4.29,4.22 110.03,96.95 100.2,4.24

### Footprints (pad centres in the part's own frame; a part is rotated, then mirrored left to right if it is on the bottom)
_0603 = smd 0.9 x 0.8: 1 -0.762,0; 2 0.762,0
0603 = smd 1.1 x 1: 1 -0.85,0; 2 0.85,0
SMADIODE = smd 2.54 x 2.54: A 2.349,0; C -2.349,0
SO18W = smd 0.66 x 2.032: 1 -5.08,-5.029; 2 -3.81,-5.029; 3 -2.54,-5.029; 4 -1.27,-5.029; 5 0,-5.029; 6 1.27,-5.029; 7 2.54,-5.029; 8 3.81,-5.029; 9 5.08,-5.029; 10 5.08,5.029; 11 3.81,5.029; 12 2.54,5.029; 13 1.27,5.029; 14 0,5.029; 15 -1.27,5.029; 16 -2.54,5.029; 17 -3.81,5.029; 18 -5.08,5.029
TO220H = drill 1.118 long: 1 -2.54,-10.16; 2 0,-10.16; 3 2.54,-10.16 | hole 3.302: 0,4.826
1X02_ROUND = drill 1 pad 1.676: 1 -1.27,0; 2 1.27,0
1X03_ROUND = drill 1 pad 1.676: 1 -2.54,0; 2 0,0; 3 2.54,0
MINI-FLAT-16 = smd 1 x 0.5: 1 -3.24,4.445; 2 -3.24,3.175; 3 -3.24,1.905; 4 -3.24,0.635; 5 -3.24,-0.635; 6 -3.24,-1.905; 7 -3.24,-3.175; 8 -3.24,-4.445; 9 3.24,-4.445; 10 3.24,-3.175; 11 3.24,-1.905; 12 3.24,-0.635; 13 3.24,0.635; 14 3.24,1.905; 15 3.24,3.175; 16 3.24,4.445
R0603 = smd 1 x 1.1: 1 -0.85,0; 2 0.85,0
M1206 = smd 1.6 x 2: 1 -1.4,0; 2 1.4,0
SMS-002 = smd 1.092 x 2.007: 1 -1.27,-4.496; 2 1.27,-4.496; 3 1.27,4.496; 4 -1.27,4.496
SOIC8_150MIL = smd 0.6 x 2.2: 1 -1.905,-2.6; 2 -0.635,-2.6; 3 0.635,-2.6; 4 1.905,-2.6; 5 1.905,2.6; 6 0.635,2.6; 7 -0.635,2.6; 8 -1.905,2.6
BEAGLEBONE_SHIELD = drill 1 square: 1 4.445,19.05; 47 52.705,19.05 | drill 1: 2 1.905,19.05; 3 4.445,21.59; 4 1.905,21.59; 5 4.445,24.13; 6 1.905,24.13; 7 4.445,26.67; 8 1.905,26.67; 9 4.445,29.21; 10 1.905,29.21; 11 4.445,31.75; 12 1.905,31.75; 13 4.445,34.29; 14 1.905,34.29; 15 4.445,36.83; 16 1.905,36.83; 17 4.445,39.37; 18 1.905,39.37; 19 4.445,41.91; 20 1.905,41.91; 21 4.445,44.45; 22 1.905,44.45; 23 4.445,46.99; 24 1.905,46.99; 25 4.445,49.53; 26 1.905,49.53; 27 4.445,52.07; 28 1.905,52.07; 29 4.445,54.61; 30 1.905,54.61; 31 4.445,57.15; 32 1.905,57.15; 33 4.445,59.69; 34 1.905,59.69; 35 4.445,62.23; 36 1.905,62.23; 37 4.445,64.77; 38 1.905,64.77; 39 4.445,67.31; 40 1.905,67.31; 41 4.445,69.85; 42 1.905,69.85; 43 4.445,72.39; 44 1.905,72.39; 45 4.445,74.93; 46 1.905,74.93; 48 50.165,19.05; 49 52.705,21.59; 50 50.165,21.59; 51 52.705,24.13; 52 50.165,24.13; 53 52.705,26.67; 54 50.165,26.67; 55 52.705,29.21; 56 50.165,29.21; 57 52.705,31.75; 58 50.165,31.75; 59 52.705,34.29; 60 50.165,34.29; 61 52.705,36.83; 62 50.165,36.83; 63 52.705,39.37; 64 50.165,39.37; 65 52.705,41.91; 66 50.165,41.91; 67 52.705,44.45; 68 50.165,44.45; 69 52.705,46.99; 70 50.165,46.99; 71 52.705,49.53; 72 50.165,49.53; 73 52.705,52.07; 74 50.165,52.07; 75 52.705,54.61; 76 50.165,54.61; 77 52.705,57.15; 78 50.165,57.15; 79 52.705,59.69; 80 50.165,59.69; 81 52.705,62.23; 82 50.165,62.23; 83 52.705,64.77; 84 50.165,64.77; 85 52.705,67.31; 86 50.165,67.31; 87 52.705,69.85; 88 50.165,69.85; 89 52.705,72.39; 90 50.165,72.39; 91 52.705,74.93; 92 50.165,74.93
MOUNTINGHOLE_3.0_PLATEDTHIN = drill 3 pad 3.6: P$1 0,0
PW16 = smd 1.676 x 0.356: 1 -2.819,2.286; 2 -2.819,1.626; 3 -2.819,0.965; 4 -2.819,0.33; 5 -2.819,-0.33; 6 -2.819,-0.965; 7 -2.819,-1.626; 8 -2.819,-2.286; 9 2.819,-2.286; 10 2.819,-1.626; 11 2.819,-0.965; 12 2.819,-0.33; 13 2.819,0.33; 14 2.819,0.965; 15 2.819,1.626; 16 2.819,2.286
SO14 = smd 0.66 x 2.032: 1 -3.81,-3.073; 2 -2.54,-3.073; 3 -1.27,-3.073; 4 0,-3.073; 5 1.27,-3.073; 6 2.54,-3.073; 7 3.81,-3.073; 8 3.81,3.073; 9 2.54,3.073; 10 1.27,3.073; 11 0,3.073; 12 -1.27,3.073; 13 -2.54,3.073; 14 -3.81,3.073
MC10 = drill 1.27 long: 1 -17.145,0; 2 -13.335,0; 3 -9.525,0; 4 -5.715,0; 5 -1.905,0; 6 1.905,0; 7 5.715,0; 8 9.525,0; 9 13.335,0; 10 17.145,0
182-009-MALE = drill 1.194 pad 1.524 octagon: 1 -5.537,10.923; 2 -2.769,10.923; 3 0,10.923; 4 2.769,10.923; 5 5.537,10.923; 6 -4.153,8.08; 7 -1.384,8.08; 8 1.384,8.08; 9 4.153,8.08 | hole 3.048: -12.446,9.501; 12.446,9.501
MC2 = drill 1.27 long: 1 -1.905,0; 2 1.905,0
MC4 = drill 1.27 long: 1 -5.715,0; 2 -1.905,0; 3 1.905,0; 4 5.715,0

### Placement (x,y rotation side)
C1  59.44,53.98 90 top
C2  79.25,79.38 0 top
C3  55.12,79.12 0 top
C4  75.69,56.01 0 top
C5  75.69,57.78 0 top
D1  106.17,6.48 270 top
IC1  13.72,32.13 90 top
IC2  13.72,71.5 90 top
IC3  59.69,29.84 90 top
JP1  60.45,77.09 270 top
JP2  67.56,84.96 180 top
JP3  92.2,86.49 180 top
JP4  83.57,77.6 270 top
JP5  73.41,89.03 0 top
JP6  49.28,88.77 0 top
JP7  49.28,85.72 0 top
JP8  74.17,81.41 90 top
OK1  102.36,22.73 180 top
OK2  102.23,37.97 180 top
OK3  102.36,62.1 180 top
OK4  102.36,77.34 180 top
OK5  31.11,26.9 180 top
OK6  31.11,37.21 180 top
OK7  30.86,65.28 180 top
OK8  30.86,75.67 180 top
R1  107.44,16.64 0 top
R2  107.7,20.7 0 top
R3  107.42,24.21 90 top
R4  107.44,27.56 90 top
R5  107.47,32.05 0 top
R6  107.57,35.92 0 top
R7  107.57,39.65 90 top
R8  107.44,43.31 90 top
R9  107.44,56.52 0 top
R10  107.7,60.33 0 top
R11  107.44,63.63 90 top
R12  107.44,67.18 90 top
R13  107.44,71.75 0 top
R14  107.7,75.56 0 top
R15  107.44,78.87 90 top
R16  107.44,82.68 90 top
R17  98.3,16.64 180 top
R18  97.28,20.7 270 top
R19  97.28,24 90 top
R20  97.28,27.3 90 top
R21  97.28,32.64 270 top
R22  97.28,35.94 270 top
R23  97.28,39.24 90 top
R24  97.28,42.55 90 top
R25  97.28,56.77 270 top
R26  97.28,60.07 270 top
R27  97.28,63.37 90 top
R28  97.28,66.67 90 top
R29  97.28,72.01 270 top
R30  97.28,75.31 270 top
R31  97.28,78.61 90 top
R32  97.28,81.92 90 top
R33  39.12,23.75 180 top
R34  39.12,26.29 180 top
R35  39.12,28.83 180 top
R36  39.12,31.37 180 top
R37  39.12,34.16 180 top
R38  39.12,36.7 180 top
R39  39.12,39.24 180 top
R40  39.12,41.53 180 top
R41  38.86,62.1 180 top
R42  38.86,64.64 180 top
R43  38.86,67.18 180 top
R44  38.86,69.72 180 top
R45  38.86,72.52 180 top
R46  38.86,75.06 180 top
R47  38.86,77.6 180 top
R48  38.86,80.14 180 top
R49  24.64,22.35 180 top
R50  24.64,25.02 180 top
R51  24.64,27.56 180 top
R52  24.64,30.1 180 top
R53  24.64,32.64 180 top
R54  25.4,35.18 180 top
R55  25.15,37.72 180 top
R56  25.15,40.26 180 top
R57  23.88,60.83 180 top
R58  23.88,63.37 180 top
R59  24.38,65.91 180 top
R60  24.38,68.45 180 top
R61  24.38,70.99 180 top
R62  24.89,73.79 180 top
R63  24.89,76.33 180 top
R64  25.15,78.87 180 top
R65  84.33,44.58 90 top
R66  84.33,41.27 270 top
R67  52.32,53.72 270 top
R68  55.37,59.31 180 top
R69  58.67,59.31 0 top
R70  58.93,48.13 270 top
R71  56.64,48.13 270 top
R72  69.6,60.07 0 top
R73  74.93,22.99 0 top
S1  56.39,66.17 180 top
U1  55.88,53.98 180 top
U$2  41.91,0 0 top
U$22  90.17,80.64 90 top
U$23  48.26,80.64 90 top
U$52  69.6,54.99 180 top
U$53  57.4,84.96 90 top
U$54  81.79,85.22 90 top
U$71  93.34,14.61 90 top
U$72  45.08,14.61 90 top
X1  110.49,32 90 top
X2  110.49,71.75 90 top
X3  4.19,32.51 270 top
X4  4.19,72.52 270 top
X5  57.66,103.76 180 top
X6  89.15,103.76 180 top
X7  110.49,6.48 90 top
X8  33.02,95.89 180 top

### Tracks (layer width: path | path; a pad name or v marks a point on that pad's centre or on a via)
3.3V  (via drill 0.6, 0.6 pad 0.25)
  Top 0.305: U$52.3 74.88,54.03 v74.93,53.98
  Top 0.61: U$54.4 88.39,85.22 JP3.3 | U$53.4 JP2.3
  Top 0.813: v35.81,22.48 34.38,22.48 OK5.1 | v35.81,25.02 34.38,25.02 OK5.3 | OK5.5 35.79,27.53 v35.81,27.56 | OK5.7 35.79,30.07 v35.81,30.1 | OK6.1 35.69,32.77 v35.81,32.64 | OK6.3 35.69,35.31 v35.81,35.18 | OK6.5 35.69,37.85 v35.81,37.97 | OK6.7 35.69,40.39 v35.81,40.51 | OK8.7 35.53,78.84 v35.56,78.87 | OK8.5 35.53,76.3 v35.56,76.33 | OK8.3 35.53,73.76 v35.56,73.79 | OK8.1 35.53,71.22 v35.56,71.25 | OK7.7 v35.56,68.45 | OK7.5 v35.56,65.91 | OK7.3 v35.56,63.37 | OK7.1 v35.56,60.83 | U$54.14 78.4,81.41 | JP8.1 76.45,80.14 77.72,81.41 78.4,81.41 | C2.1 78.4,81.41 | U1.8 57.78,53.09 v57.4,53.47 | R67.2 52.74,52.87 53.34,53.47 v57.4,53.47 | C1.1 57.66,53.21 v57.4,53.47 | U$53.14 53.85,81.15 v52.83,80.14 53.85,79.12 C3.1 | R70.2 v58.93,45.85 | v60.96,59.31 R69.2 | v53.09,59.31 R68.2 | R65.2 v84.33,46.86 | v84.33,38.99 R66.2 | C4.1 74.84,54.06 v74.93,53.98
  pour VCC (isolate 0.406): 34.29,17.4 34.29,82.42 25.65,91.06 25.4,91.06 25.4,97.41 99.06,97.41 99.06,17.4 89.92,17.4 89.92,33.4 48.01,33.4 48.01,17.4
5.0V
  Top 0.813: U$2.54 U$2.53
+24V  (via drill 0.6 pad 0.25)
  Top 0.813: 113.28,16.89 113.28,13.08 112.01,11.81 107.7,11.81 106.17,10.29 | 113.28,16.89 113.28,20.7 | 113.28,20.7 113.28,24.26 | 113.28,24.26 113.28,28.32 | 113.28,28.32 113.28,32.13 | R2.2 113.28,20.7 | 113.28,16.89 113.03,16.64 R1.2 | 113.28,24.26 113.03,24.51 108.46,24.51 107.91,25.06 R3.2 | 113.28,28.32 107.53,28.32 R4.2 | R5.2 108.39,32.13 113.28,32.13 | 113.28,32.13 113.28,36.2 | 113.28,36.2 113.28,39.75 | 113.28,39.75 113.28,43.56 | 113.28,43.56 113.28,56.77 | 113.28,56.77 113.28,60.33 | 113.28,60.33 113.28,64.14 | 113.28,64.14 113.28,68.2 | 113.28,68.2 113.28,72.26 | 113.28,72.26 113.28,75.56 | 113.28,75.56 113.28,79.38 | 113.28,79.38 113.28,83.19 108.71,83.19 108.37,83.53 R16.2 | R9.2 113.03,56.52 113.28,56.77 | R10.2 113.28,60.33 | R11.2 108.37,64.48 108.71,64.14 113.28,64.14 | R12.2 113.12,68.03 113.28,68.2 | R14.2 113.28,75.56 | R13.2 112.78,71.75 113.28,72.26 | R15.2 108.37,79.72 108.71,79.38 113.28,79.38 | 107.58,40.51 R7.2 108.06,40.5 108.81,39.75 113.28,39.75 | R8.2 108.12,44.16 108.71,43.56 113.28,43.56 | R6.2 113,35.92 113.28,36.2 | R50.2 v22.05,25.02 | v22.05,27.56 R51.2 | v22.05,30.1 R52.2 | v22.05,32.64 R53.2 | v23.29,35.18 R54.2 | v22.86,37.72 R55.2 | v22.86,40.26 R56.2 | v22.81,78.87 R64.2 | v22.78,76.33 R63.2 | v22.78,73.79 R62.2 | v21.84,70.99 R61.2 | v21.84,68.45 R60.2 | v21.79,65.91 R59.2 | v21.59,63.37 R58.2 | v21.59,60.83 R57.2 | v21.84,22.48 23.15,22.48 23.28,22.35 R49.2
  Top 2.54: v103.38,10.29 106.17,10.29 D1.C
  pour VCC: 52.07,28.07 85.85,28.32 85.85,11.81 114.05,11.81 114.05,0.38 0.25,0.38 0.25,95.38 14.73,95.38 28.19,81.92 28.19,12.32 27.69,11.81 52.07,11.81
GND  (via drill 0.6 pad 0.25, 1.1)
  Top 0.305: U$52.14 69.55,54.03 v69.6,53.98 70.21,53.37 U$52.2
  Top 0.813: OK3.15 100.96,58.93 v101.09,58.8 | OK3.13 100.96,61.47 v101.09,61.59 | OK3.11 100.96,64.01 v101.09,63.88 | OK3.9 100.96,66.55 v101.09,66.42 | OK4.15 100.96,74.17 v101.09,74.3 | OK4.13 100.96,76.71 v101.09,76.83 | OK4.11 100.96,79.25 v101.09,79.38 | OK4.9 100.96,81.79 v101.09,81.66 | OK2.9 100.71,42.42 v100.84,42.29 | OK2.11 100.71,39.88 v100.84,39.75 | OK2.13 100.71,37.34 v100.84,37.21 | OK2.15 100.71,34.8 v100.84,34.92 | OK1.9 100.96,27.18 v101.09,27.05 | OK1.11 100.96,24.64 v101.09,24.77 | OK1.13 100.96,22.1 v101.09,22.23 | OK1.15 100.96,19.56 v101.09,19.68 | v82.8,89.03 U$54.7 | U$53.7 v62.48,88.77 | C2.2 80.1,77.69 v80.01,77.6 | v82.8,83.95 U$54.3 | U$53.3 v58.42,83.69 | S1.1 56.64,70.66 | 56.64,70.66 S1.2 | C1.2 v59.44,57.02 | U1.4 53.03,56.58 v52.58,57.02 | v56.39,72.26 56.64,72.01 56.64,70.66 | R71.2 v56.64,45.85 | C5.2 77.47,57.78 v78.49,56.77 77.72,56.01 C4.2 | R72.2 70.45,54.83 v69.6,53.98 | C3.2 55.97,77.51 v56.13,77.34
  Top 1.778: v61.21,36.45 61.21,34.42 65.79,29.84 IC3.2 71.63,29.84 76.33,25.14 R73.2
  pour GND: 101.85,97.41 101.85,17.4 89.92,17.4 89.92,33.4 48.01,33.4 48.01,17.4 34.29,17.4 34.29,82.42 25.4,91.06 25.4,97.41
GNDI  (via drill 1.1)
  Top 0.813: IC1.9 18.74,38.02 7.11,49.66 X3.1 | IC2.9 18.74,77.9 7.11,89.53 4.32,89.53 X4.1
  Top 1.778: R73.1 v71.37,22.99
  pour GND: 105.41,95.12 113.54,95.12 113.54,0.89 78.23,0.89 78.23,19.94 55.88,19.94 55.88,1.14 0.76,0.89 0.76,95.12 15.05,95.12 28.19,81.98 28.19,11.81 52.07,11.81 52.07,28.07 85.85,28.07 85.85,11.81 105.41,11.81
IDI0
  Top 0.203: R17.2 96.69,17.4 90.17,17.4 87.88,19.68 87.88,37.21 90.04,39.37 U$2.64
IDI1
  Top 0.203: 96.81,20.32 90.25,20.32 88.65,21.92 88.65,35.18 90.3,36.83 U$2.62
  Top 0.305: R18.2 96.81,20.32
IDI2
  Top 0.203: R19.2 96.73,25.4 90.37,25.4 89.41,26.36 89.41,32.64 91.06,34.29 U$2.60
IDI3
  Top 0.203: 91.31,31.75 90.17,30.61 90.17,28.96 91.19,27.94 97.07,27.94
  Top 0.305: R20.2 97.07,27.94 | 91.31,31.75 U$2.58
IDI4
  Top 0.305: R21.2 94.65,31.79 U$2.57
IDI5
  Top 0.305: R22.2 95.42,35.09 U$2.59
IDI6
  Top 0.305: U$2.61 94.87,36.83 96.01,37.97 96.01,39.5 96.52,40.01 97.19,40.01 R23.2
IDI7
  Top 0.305: U$2.63 96.01,40.77 96.01,42.8 96.52,43.31 97.19,43.31 R24.2
IDI8
  Top 0.305: R25.2 97.28,51.18 95.63,49.53 U$2.71
IDI9
  Top 0.305: R26.2 96.94,59.22 96.01,58.29 96.01,53.21 94.87,52.07 U$2.73
IDI10
  Top 0.203: R27.2 96.35,64.22 95.63,63.5 90.98,63.5 90.42,62.94 90.42,59.05 91.06,58.42 93.34,58.42 U$2.77
IDI11
  Top 0.203: 96.86,67.53 95.38,66.04 90.75,66.04 89.66,64.95 89.66,56.52 90.3,55.88 93.34,55.88 U$2.75
  Top 0.305: R28.2 96.86,67.53
IDI12
  Top 0.203: R29.2 97.28,69.72 96.14,68.58 90.42,68.58 88.9,67.06 88.9,56.01 90.3,54.61 U$2.76
IDI13
  Top 0.305: R30.2 96.69,74.46 96.01,73.79 96.01,71.25 U$2.87
IDI14
  Top 0.305: R31.2 96.35,79.46 94.49,77.6 90.68,77.6 90.17,77.09 90.17,70.48 88.14,68.45 88.14,54.74 90.8,52.07 U$2.74
IDO0
  Top 0.305: R33.1 42.12,21.59 U$2.4
IDO1
  Top 0.203: 46.35,21.74 45.24,22.86 43.15,22.86 39.97,26.05
  Top 0.305: 40.13,26.29 R34.1 39.97,26.05 | 46.35,21.74 U$2.3
IDO2
  Top 0.305: R35.1 41.4,27.39 41.4,26.04 43.31,24.13 U$2.6
IDO3
  Top 0.305: R36.1 41.91,29.43 41.91,28.32 43.56,26.67 U$2.8
IDO4
  Top 0.305: R37.1 41.91,32.22 41.91,31.11 U$2.10
IDO5
  Top 0.203: R38.1 41.11,35.56 47.85,35.56 48.51,34.9 48.51,30.35 47.37,29.21
  Top 0.305: 47.37,29.21 U$2.9
IDO6
  Top 0.203: U$2.7 48.13,26.67 49.28,27.81 49.28,37.46 48.64,38.1 42.04,38.1 40.89,39.24 R39.1
IDO7
  Top 0.203: R40.1 40.85,40.64 48.72,40.64 50.04,39.32 50.04,26.04 48.13,24.13 U$2.5
IDO8  (via drill 0.6 pad 0.25)
  Top 0.305: v39.62,45.34 39.62,62.1 R41.1
  Bottom 0.305: v39.62,45.34 39.62,43.31 43.69,39.24 U$2.18
IDO9
  Top 0.305: R42.1 39.62,64.64 39.62,64.14 41.15,62.61 41.15,47.12 U$2.22
IDO10  (via drill 0.6 pad 0.25)
  Top 0.305: R43.1 39.62,67.18 39.62,66.42 40.89,66.42 v40.89,66.17
  Bottom 0.305: v40.89,66.17 40.89,49.66 43.69,46.86 U$2.24
IDO11
  Top 0.305: R44.1 42.16,67.27 42.16,51.18 U$2.26
IDO12
  Top 0.203: R45.1 41.11,71.12 48.01,71.12 48.51,70.61 48.51,50.67 47.37,49.53 U$2.25
IDO13
  Top 0.203: U$2.23 47.88,46.99 49.28,48.39 49.28,72.44 48.06,73.66 41.76,73.66 40.36,75.06 R46.1
IDO14  (via drill 0.6 pad 0.25)
  Top 0.203: v86.61,49.4 89.66,49.4 90.8,48.26 93.45,48.26 94.61,47.09
  Top 0.305: R47.1 39.62,77.6 39.62,76.83 46.99,76.83 48.51,75.31 55.63,75.31 59.44,71.5 74.68,71.5 v75.18,70.99 | 94.61,47.09 U$2.69
  Bottom 0.305: v75.18,70.99 75.95,70.99 85.34,61.59 85.34,51.69 86.61,50.42 v86.61,49.4
IDO15  (via drill 0.6 pad 0.25)
  Top 0.305: v88.14,72.26 59.69,72.26 55.88,76.07 48.77,76.07 47.24,77.6 42.93,77.6 41.15,79.38 39.88,79.38 39.62,79.63 39.62,80.14 R48.1
  Bottom 0.305: v88.14,72.26 89.66,72.26 U$2.88
N$1
  Top 0.406: OK4.8 105.6,84.14 106.55,85.09 X2.9
N$2
  Top 0.406: OK4.7 106.13,80.52 R16.1
N$3
  Top 0.406: OK4.5 107.4,77.98 R15.1
N$4  (via drill 0.6 pad 0.25)
  Top 0.406: OK4.6 105.47,79.38 v103.63,79.38
  Bottom 0.406: v103.63,79.38 108.46,79.38 110.49,81.41 X2.8
N$5
  Top 0.406: OK4.4 105.73,76.83 109.85,76.83 X2.7
N$6
  Top 0.406: OK4.3 105.73,75.56 R14.1
N$7
  Top 0.406: OK4.2 105.73,74.04 106.43,74.04 106.81,73.66 X2.6
N$8
  Top 0.406: R13.1 105.6,72.75 OK4.1
N$9
  Top 0.406: OK3.8 105.6,68.39 107.06,69.85 X2.5
N$10
  Top 0.406: OK3.7 106.3,65.28 106.93,65.91 107.02,65.91 R12.1
N$11  (via drill 0.6 pad 0.25)
  Top 0.406: OK3.6 105.47,64.14 v103.63,64.14
  Bottom 0.406: v103.63,64.14 108.46,64.14 110.49,66.17 X2.4
N$12
  Top 0.406: OK3.5 107.4,62.74 R11.1
N$13
  Top 0.406: OK3.4 105.73,61.59 109.85,61.59 X2.3
N$14
  Top 0.406: OK3.3 105.73,60.33 R10.1
N$15
  Top 0.406: OK4.10 98.17,80.52 97.62,81.06 R32.1
N$16
  Top 0.406: OK4.12 97.5,77.98 R31.1
N$17
  Top 0.406: OK4.14 98.68,75.44 98.04,76.07 97.37,76.07 R30.1
N$18
  Top 0.406: OK4.16 97.32,72.9 R29.1
N$19
  Top 0.406: OK3.10 98.42,65.28 97.88,65.83 R28.1
N$20
  Top 0.406: OK3.12 97.5,62.74 R27.1
N$21
  Top 0.406: OK3.14 98.68,60.2 98.04,60.83 97.37,60.83 R26.1
N$22
  Top 0.406: OK2.10 98.42,41.15 98.04,41.53 97.45,41.53 R24.1
N$23
  Top 0.406: OK2.12 97.5,38.61 R23.1
N$24
  Top 0.406: OK2.14 98.68,36.07 98.04,36.7 97.37,36.7 R22.1
N$25
  Top 0.406: OK2.16 97.32,33.53 R21.1
N$26
  Top 0.406: OK1.10 98.42,25.91 98.04,26.29 97.45,26.29 R20.1
N$27
  Top 0.406: OK1.12 97.5,23.37 R19.1
N$28
  Top 0.406: OK1.14 98.68,20.83 98.04,21.46 97.37,21.46 R18.1
N$29
  Top 0.406: OK1.4 105.73,22.23 110.24,22.23 X1.3
N$30
  Top 0.406: R2.1 106.72,20.83 OK1.3
N$31
  Top 0.406: R3.1 OK1.5
N$32  (via drill 0.6 pad 0.25)
  Top 0.406: OK1.6 105.47,24.77 v103.63,24.77
  Bottom 0.406: v103.63,24.77 108.97,24.77 X1.4
N$33
  Top 0.406: R4.1 106.85,26.71 106.05,25.91 OK1.7
N$34
  Top 0.406: OK1.8 105.6,28.77 106.93,30.1 X1.5
N$35
  Top 0.406: OK2.2 106.3,34.8 107.19,33.91 X1.6
N$36
  Top 0.406: R5.1 106.62,32.39 OK2.1
N$37
  Top 0.406: OK2.3 106.57,36.07 R6.1
N$38
  Top 0.406: OK2.4 110.11,37.34 X1.7
N$39
  Top 0.406: OK2.5 107.38,38.61 R7.1
N$40  (via drill 0.6 pad 0.25)
  Top 0.406: OK2.6 105.35,40.01 v103.63,40.01
  Bottom 0.406: v103.63,40.01 108.97,40.01 X1.8
N$41
  Top 0.406: OK2.7 106.13,41.15 R8.1
N$42
  Top 0.406: OK2.8 105.47,44.39 106.43,45.34 X1.9
N$43
  Top 0.406: X1.2 107.19,18.67 106.3,19.56 OK1.2
N$44
  Top 0.406: R1.1 105.6,17.63 OK1.1
N$45
  Top 0.406: OK1.16 99.12,16.66 R17.1
N$46
  Top 0.406: OK3.2 106.81,58.93 107.31,58.42 X2.2
N$47
  Top 0.406: OK3.1 105.6,57.51 R9.1
N$48
  Top 0.406: OK3.16 97.32,57.66 R25.1
N$49
  Top 0.305: R33.2 38.24,23.72 OK5.2
N$50
  Top 0.305: R34.2 38.24,26.26 OK5.4
N$51
  Top 0.305: R35.2 34.35,28.83 OK5.6
N$52
  Top 0.305: OK5.8 34.38,31.37 R36.2
N$53
  Top 0.305: OK6.2 38.14,34.04 R37.2
N$54
  Top 0.305: OK6.4 38.14,36.58 R38.2
N$55
  Top 0.305: OK6.6 38.14,39.12 R39.2
N$56
  Top 0.305: OK6.8 38.14,41.66 R40.2
N$57
  Top 0.305: R41.2 OK7.2
N$58
  Top 0.305: R42.2 OK7.4
N$59
  Top 0.305: R43.2 OK7.6
N$60
  Top 0.305: R44.2 OK7.8
N$61
  Top 0.305: R45.2 37.99,72.49 OK8.2
N$62
  Top 0.305: R46.2 37.99,75.03 OK8.4
N$63
  Top 0.305: R47.2 37.99,77.57 OK8.6
N$64
  Top 0.305: R48.2 37.99,80.11 OK8.8
N$65
  Top 0.406: OK5.16 25.59,22.45 R49.1
N$66
  Top 0.406: OK5.14 25.51,24.99 R50.1
N$67
  Top 0.406: OK5.12 25.51,27.53 R51.1
N$68
  Top 0.406: OK5.10 25.51,30.07 R52.1
N$69
  Top 0.406: OK6.16 25.61,32.77 R53.1
N$70
  Top 0.406: OK6.14 26.12,35.31 R54.1
N$71
  Top 0.406: OK6.12 26.12,37.85 R55.1
N$72
  Top 0.406: OK6.10 26.12,40.39 R56.1
N$73
  Top 0.406: IC1.8 19.81,35.94 20.57,36.7 20.57,39.75 22.48,41.66 OK6.9
N$74
  Top 0.406: OK6.11 21.97,39.12 21.59,38.73 21.59,36.7 21.34,36.45 21.34,36.2 19.81,34.67 IC1.7
N$75
  Top 0.406: OK6.13 22.73,36.58 22.1,35.94 22.1,35.69 19.81,33.4 IC1.6
N$76
  Top 0.406: OK6.15 21.72,34.04 19.81,32.13 IC1.5
N$77
  Top 0.406: OK5.9 20.29,31.34 19.81,30.86 IC1.4
N$78
  Top 0.406: OK5.11 20.85,28.8 20.07,29.59 IC1.3
N$79
  Top 0.406: OK5.13 21.61,26.26 20.57,27.3 20.57,27.81 20.07,28.32 IC1.2
N$80
  Top 0.406: OK5.15 21.61,23.72 19.56,25.78 19.56,26.24 IC1.1
N$81
  Top 0.406: OK8.14 25.77,73.76 R62.1
N$82
  Top 0.406: OK8.12 25.77,76.3 R63.1
N$83
  Top 0.406: OK8.10 26.02,78.84 R64.1
N$84
  Top 0.406: OK8.9 22.07,80.11 20.57,78.61 20.57,76.07 19.81,75.31 IC2.8
N$85
  Top 0.406: OK8.11 22.33,77.57 21.59,76.83 21.59,75.56 20.07,74.04 IC2.7
N$86
  Top 0.406: OK8.13 22.33,75.03 20.07,72.77 IC2.6
N$87
  Top 0.406: OK8.15 21.31,72.49 20.32,71.5 IC2.5
N$88
  Top 0.406: OK8.16 27.62,70.99 R61.1
N$89
  Top 0.406: OK7.10 R60.1
N$90
  Top 0.406: OK7.12 R59.1
N$91
  Top 0.406: OK7.9 20.32,69.72 19.81,70.23 IC2.4
N$92
  Top 0.406: OK7.11 21.49,67.18 19.81,68.86 19.81,68.96 IC2.3
N$93
  Top 0.406: OK7.13 21.44,64.64 20.68,65.41 20.68,66.83 19.81,67.69 IC2.2
N$94
  Top 0.406: OK7.14 R58.1
N$95
  Top 0.406: OK7.16 R57.1
N$96
  Top 0.406: OK7.15 20.57,62.1 19.05,63.63 19.05,66.12 IC2.1
N$97
  Top 0.61: IC2.18 8.64,66.42 8.64,57.02 5.84,57.02 X4.10
N$98
  Top 0.61: IC2.10 8.38,76.58 8.38,81.92 4.32,85.98 X4.2
N$99  (via drill 0.6 pad 0.25)
  Top 0.61: IC2.11 v10.92,75.31 11.18,75.31
  Bottom 0.61: X4.3 v10.92,75.31
N$100  (via drill 0.6 pad 0.25)
  Top 0.61: IC2.17 10.41,67.69 11.18,66.93 v11.18,66.67
  Bottom 0.61: v11.18,66.67 11.18,66.17 X4.9
N$101
  Top 0.61: X4.4 6.35,76.07 6.35,75.56 6.86,75.06 6.86,74.55 7.37,74.04 IC2.12
N$102
  Top 0.61: IC2.13 7.11,72.77 5.59,74.3 4.32,74.3 X4.5
N$103
  Top 0.61: IC2.14 7.37,71.5 6.6,70.74 4.32,70.74 X4.6
N$104
  Top 0.61: X4.7 7.62,70.23 IC2.15
N$105  (via drill 0.6 pad 0.25)
  Top 0.61: IC2.16 10.67,68.96 10.92,69.22 v10.92,68.96
  Bottom 0.61: v10.92,68.96 10.92,68.2 9.91,67.18 9.91,66.42 6.35,62.87 4.32,62.87 X4.8
N$106
  Top 0.61: IC1.14 5.71,32.13 X3.6
N$107
  Top 0.61: IC1.13 5.21,33.4 X3.5
N$108
  Top 0.406: IC1.12 7.62,34.67 | 4.32,38.23 X3.4
  Top 0.61: 4.32,38.23 6.1,36.45 6.1,36.2 7.62,34.67
N$109
  Top 0.813: IC1.15 7.37,30.86 6.86,30.35 6.86,29.84 4.32,27.3 4.32,26.8 X3.7
N$110  (via drill 0.6 pad 0.25)
  Top 0.61: IC1.16 v10.92,29.59 11.18,29.59
  Bottom 0.61: v10.92,29.59 10.41,29.08 10.16,29.08 9.65,28.57 9.65,25.78 6.86,22.99 X3.8
N$111  (via drill 0.6 pad 0.25)
  Top 0.61: IC1.17 10.92,28.32 11.18,28.07 11.43,28.07 v11.43,27.81
  Bottom 0.61: v11.43,27.81 10.67,27.05 10.67,25.27 4.57,19.18 X3.9
N$112  (via drill 0.6 pad 0.25)
  Top 0.61: IC1.11 v10.92,35.94 11.18,35.94
  Bottom 0.61: v10.92,35.94 4.83,42.04 X3.3
N$113
  Top 0.61: IC1.10 8.69,44.02 6.86,45.85 X3.2
N$114
  Top 0.61: IC1.18 8.69,19.86 X3.10
N$115
  Top 1.778: X7.1 110.05,4.13 D1.A
N$116
  Top 0.305: U$52.8 74.33,57.28 C5.1
N$117
  Top 0.305: R72.1 68.75,57.95 68.07,57.28 U$52.9
N$118
  Top 0.406: U$54.6 87.88,87.76 88.39,88.27 90.42,88.27 JP3.2
N$119
  Top 0.406: S1.4 57.66,59.48 R69.1 57.82,56.61 U1.1
N$120
  Top 0.406: U1.7 56.64,51.25 R71.1 R70.1
N$121
  Top 0.406: U$53.6 65.02,87.5 JP2.2
N$122
  Top 0.406: U$53.13 52.83,82.42 50.55,84.71 JP7.2
N$123
  Top 0.406: U$53.8 JP6.2
N$124
  Top 0.406: U$54.8 JP5.2
N$125
  Top 0.813: U$54.1 84.86,80.16 JP4.1
N$126
  Top 0.813: U$53.1 60.48,78.38 JP1.1
N$127
  Top 0.406: U$54.13 JP8.2
N$128  (via drill 0.6 pad 0.25)
  Top 0.305: U$52.13 64.59,54.66 63.75,55.5 v63.75,59.56
  Bottom 0.305: X8.4 30.86,92.33 37.08,92.33 44.45,84.96 44.45,79.12 49.28,74.3 49.28,74.04 v63.75,59.56
N$129  (via drill 0.6 pad 0.25)
  Top 0.305: U$52.12 65.46,55.32 64.77,56.01 64.77,59.05 v65.28,59.56
  Bottom 0.305: X8.2 45.21,85.6 45.21,79.63 v65.28,59.56
N$130
  Top 0.406: U$54.9 80.01,87.76 80.52,88.27 80.52,90.3 81.28,91.06 84.61,91.06 X6.4
N$131
  Top 0.406: X5.3 56.9,92.07 56.9,87.25 55.88,86.23 U$53.10
N$132
  Top 0.406: X5.4 54.89,90.78 56.13,89.53 56.13,88.01 55.63,87.5 U$53.9
N$133
  Top 0.406: X5.1 63.19,92.53 60.96,90.3 59.44,90.3 58.67,89.53 58.67,85.98 56.39,83.69 U$53.12
N$134
  Top 0.406: X5.2 57.66,90.07 57.66,86.49 56.13,84.96 U$53.11
N$135  (via drill 0.6 pad 0.25)
  Top 0.406: U$54.11 80.01,85.22 82.3,87.5 v82.55,87.5
  Bottom 0.406: v82.55,87.5 85.09,87.5 88.9,91.31 90.4,91.31 X6.2
N$136  (via drill 0.6 pad 0.25)
  Top 0.406: U$54.12 80.01,83.95 82.3,86.23 82.55,86.23 v82.55,85.98
  Bottom 0.406: v82.55,85.98 84.84,85.98 89.15,90.3 92.15,90.3 X6.1
N$137
  Top 0.406: U$54.10 80.01,86.49 81.53,88.01 81.53,89.79 82.04,90.3 86.61,90.3 X6.3
N$139
  Top 0.406: U1.2 56.51,59.02 R68.1 56.22,60.57 S1.3
N$140
  Top 0.406: U1.3 55.24,55.37 54.36,54.48 52.41,54.48 R67.1
RAW_5V
  Bottom 1.778: U$2.51 U$2.52 88.27,24.13 80.01,32.38 IC3.3
RS422_RX  (via drill 0.6 pad 0.25)
  Top 0.305: U$53.2 v64.01,82.42
  Bottom 0.305: v64.01,82.42 64.52,82.42 73.66,73.28 73.66,70.74 74.93,69.47 76.45,69.47 84.58,61.34 84.58,51.44 85.34,50.67 85.34,48.9 89.79,44.45 U$2.68
RS422_TX  (via drill 0.6 pad 0.25)
  Top 0.305: U$53.5 v62.48,86.23
  Bottom 0.203: v62.48,86.23 62.48,85.47 86.11,61.85 86.11,51.94 89.41,48.64 89.41,46.86 90.55,45.72 93.45,45.72 94.61,44.55
  Bottom 0.305: 94.61,44.55 U$2.67
RS485_RX
  Top 0.305: U$54.2 86.11,82.68 86.87,81.92 86.87,75.82 89.41,73.28 89.41,71.25 86.87,68.71 86.87,54.74 U$2.72
RS485_TX  (via drill 0.6 pad 0.25)
  Top 0.406: U$54.5 v87.12,86.49
  Bottom 0.305: U$2.70 86.87,52.2 86.87,86.23 v87.12,86.49
SCL  (via drill 0.6 pad 0.25)
  Top 0.203: R65.1 89.24,43.73 89.79,43.18 93.34,43.18 U$2.65
  Top 0.305: R65.1 84.33,43.81 81.79,43.81 v81.53,43.56 | v81.53,43.56 80.77,42.8 57.91,42.8 54.86,45.85 54.86,49.4 55.24,49.78 U1.6 | U$52.16 66.04,52.7 65.53,52.2 65.53,45.85 66.04,45.34 80.01,45.34 81.53,43.81 v81.53,43.56
SDA  (via drill 0.6 pad 0.25)
  Top 0.305: U$2.66 91.86,42.12 R66.1 84.33,42.04 v81.53,42.04 57.63,42.04 53.97,45.69 U1.5 | U$52.15 65.18,53.37 64.52,52.7 64.52,45.59 66.55,43.56 78.99,43.56 v79.5,44.07
  Bottom 0.305: v81.53,42.04 v79.5,44.07

### Text on the board
tPlace: P8 | P9 | WE | 1 | 1 | BB-DIO-Cape / by Louis McCarthy 2013